# EAGLE design Margay (EAGLE 9.6.2)

## Sheet 1 of 3
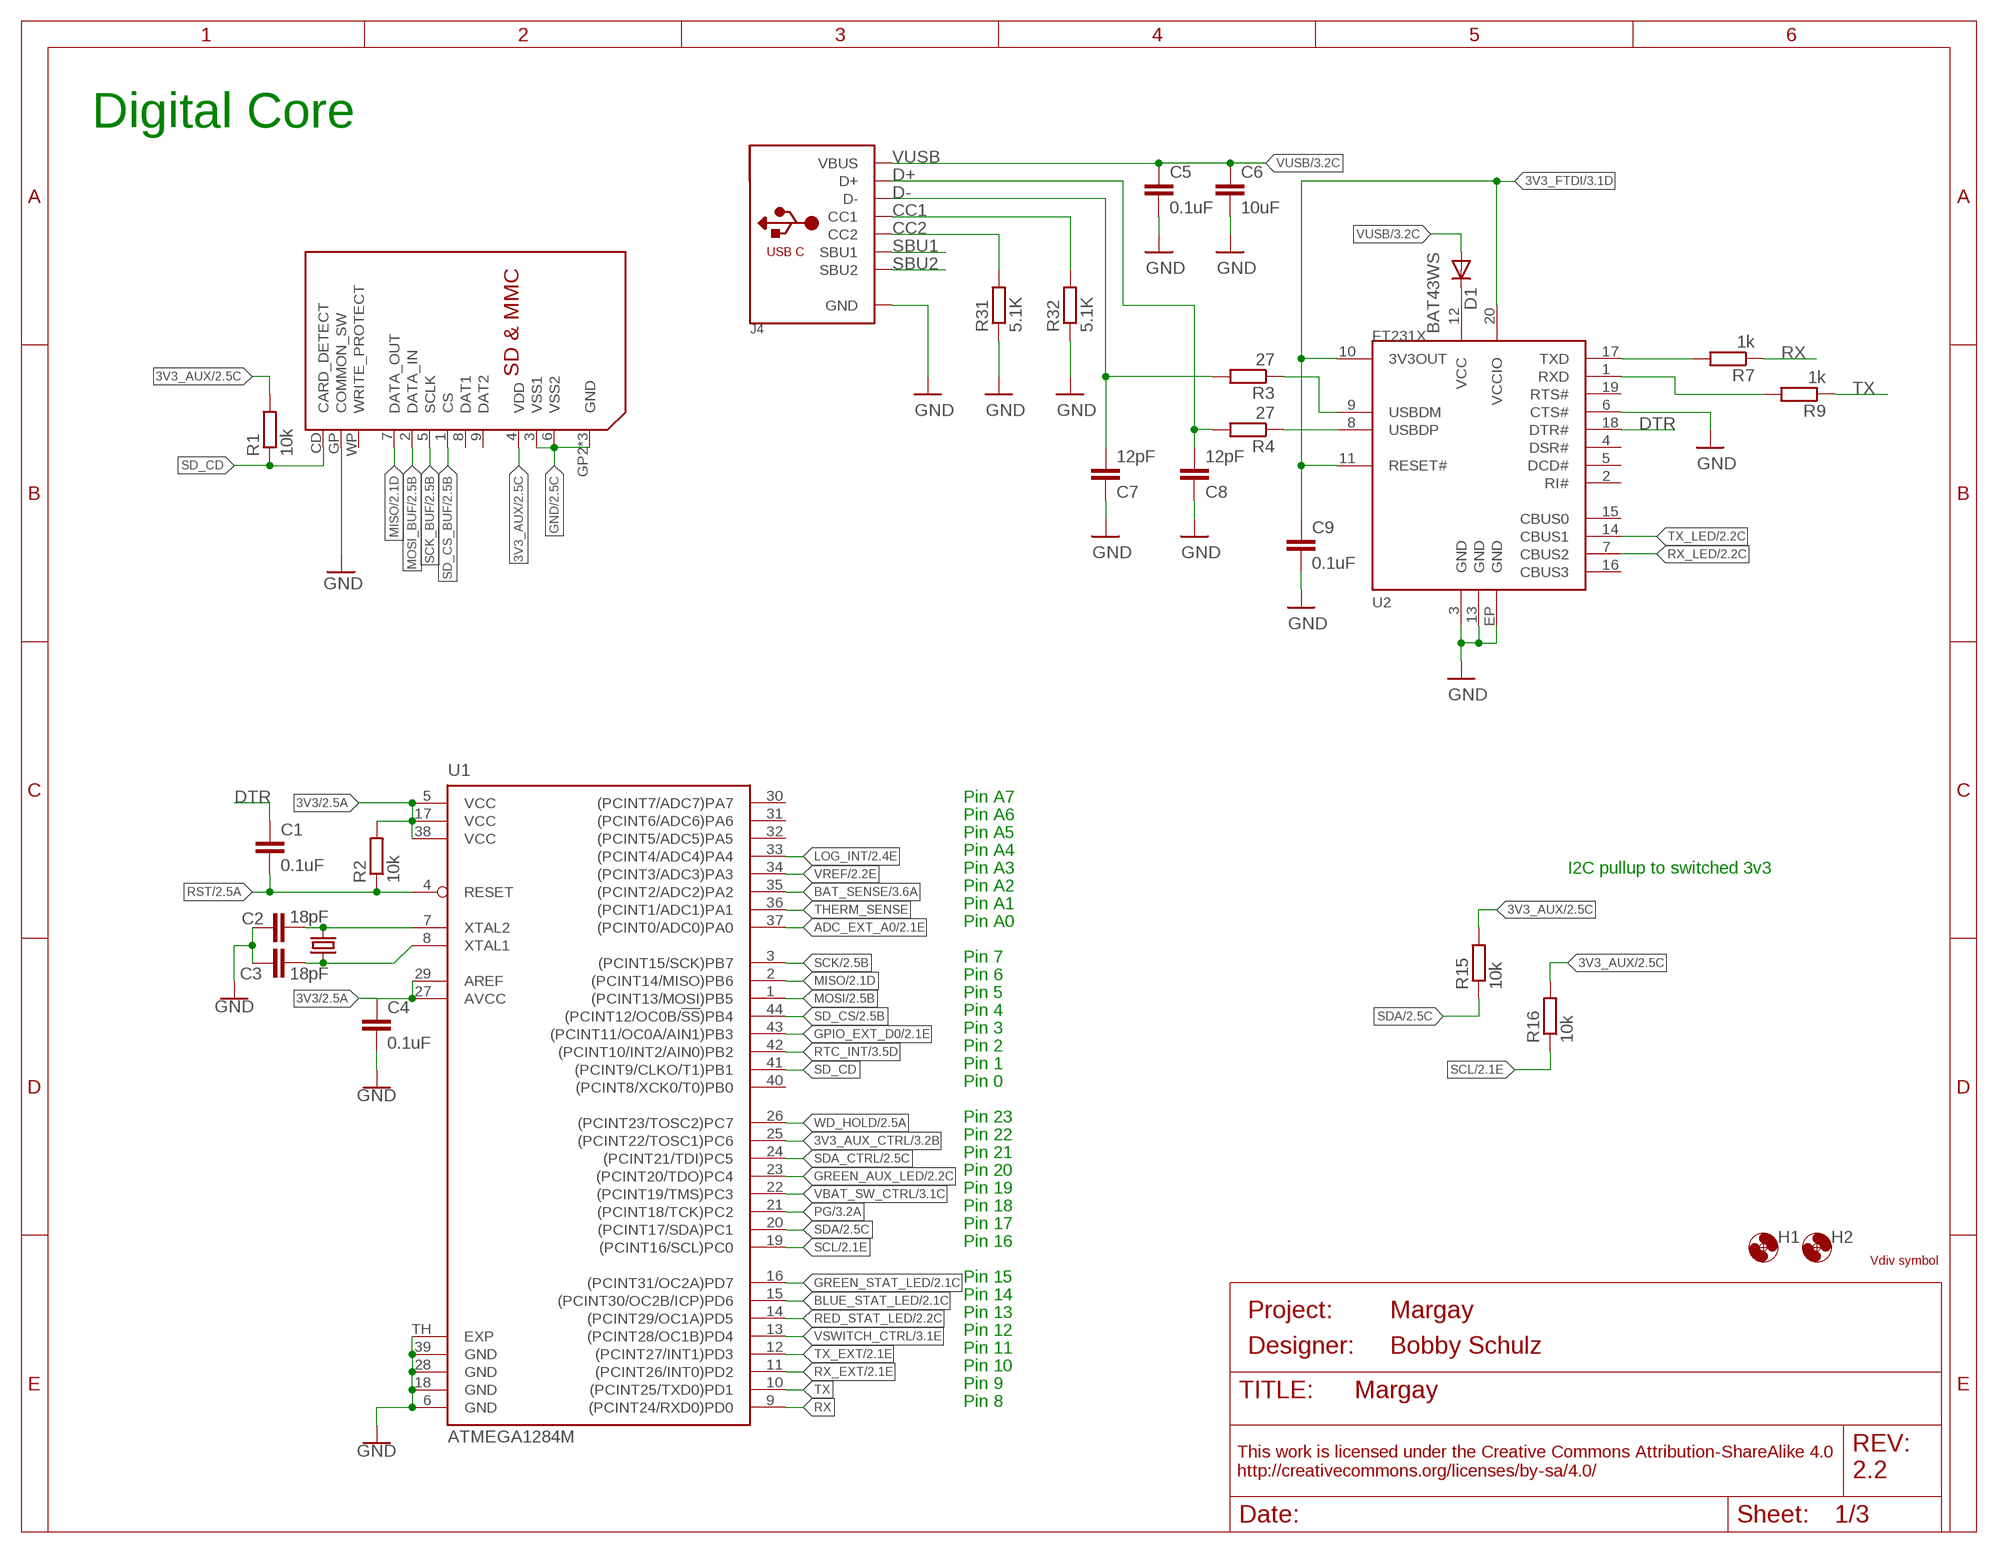
[diagram p0: schematic, sheet 1]
FRAME1 (FRAME_A_L): DESIGNER: Bobby Schulz; PROJECT: Margay; REV: 2.2

### Parts
C1  0.1uF  C-EU0.1UFC0402  [C0402]
C2  18pF  C-EU18PFC0402  [C0402]
C3  18pF  C-EU18PFC0402  [C0402]
C4  0.1uF  C-EU0.1UFC0402  [C0402]
C5  0.1uF  C-EU0.1UFC0402  [C0402]
C6  10uF  C-EU10UFC0805  [C0805]
C7  12pF  C-EU12PFC0402  [C0402]
C8  12pF  C-EU12PFC0402  [C0402]
C9  0.1uF  C-EU0.1UFC0402  [C0402]
D1  BAT43WS  DIODESOD-323  [SOD323-R]
H1  MOUNTING_HOLE4_NP_CLOSE  [4_40_CLOSE]
H2  MOUNTING_HOLE4_NP_CLOSE  [4_40_CLOSE]
J1  SDMMCWR-CRD  [SD_WURTH_WR-CRD]
J4  USB_C  [USB_C_CUSB31-CFM2AX-01-X]
R1  10k  R-EU_10KR0402  [R0402]
R2  10k  R-EU_10KR0402  [R0402]
R3  27  R-EU_27R0402  [R0402]
R4  27  R-EU_27R0402  [R0402]
R7  1k  R-EU_1KR0402  [R0402]
R9  1k  R-EU_1KR0402  [R0402]
R15  10k  R-EU_10KR0402  [R0402]
R16  10k  R-EU_10KR0402  [R0402]
R31  5.1K  R-EU_5.1KR0402  [R0402]
R32  5.1K  R-EU_5.1KR0402  [R0402]
U1  ATMEGA1284M  [MLF44-TH]
U2  FT231X-Q  [QFN20]
U$1  VDIV_MARGAYFULL-VDIV  [VDIV_MARGAY_2021]
XTAL1  CRYSTAL8MHZ5X3.2  [CRYSTAL_5X3.2_2-SMD]

### Nets
3V3: C4.1 R2.2 U1.5(VCC) U1.17(VCC) U1.27(AVCC) U1.29(AREF) U1.38(VCC) ; also sheet 2,3
3V3_AUX: J1.4(VDD) R1.2 R15.2 R16.2 ; also sheet 2,3
3V3_AUX_CTRL: U1.25((PCINT22/TOSC1)PC6) ; also sheet 3
3V3_FTDI: C9.1 U2.10(3V3OUT) U2.11(RESET#) U2.20(VCCIO) ; also sheet 3
ADC_EXT_A0: U1.37((PCINT0/ADC0)PA0) ; also sheet 2
BAT_SENSE: U1.35((PCINT2/ADC2)PA2) ; also sheet 3
BLUE_STAT_LED: U1.15((PCINT30/OC2B/ICP)PD6) ; also sheet 2
CC1: J4.A5(CC1) R32.2
CC2: J4.B5(CC2) R31.2
D+: C8.2 J4.A6(D+) J4.B6(D+) R4.2
D-: C7.2 J4.A7(D-) J4.B7(D-) R3.2
DTR: C1.1 U2.18(DTR#)
GND: C2.1 C3.1 C4.2 C5.2 C6.2 C7.1 C8.1 C9.2 J1.3(VSS1) J1.6(VSS2) J1.GP2(GND) J1.GP3(GND) J1.GP4(GND) J1.GP(COMMON_SW) J4.A1B12(GND) J4.B1A12(GND) R31.1 R32.1 U1.6(GND) U1.18(GND) U1.28(GND) U1.39(GND) U1.TH(EXP) U2.3(GND) U2.6(CTS#) U2.13(GND) U2.EP(GND) ; also sheet 2,3
GPIO_EXT_D0: U1.43((PCINT11/OC0A/AIN1)PB3) ; also sheet 2
GREEN_AUX_LED: U1.23((PCINT20/TDO)PC4) ; also sheet 2
GREEN_STAT_LED: U1.16((PCINT31/OC2A)PD7) ; also sheet 2
LOG_INT: U1.33((PCINT4/ADC4)PA4) ; also sheet 2
MISO: J1.7(DATA_OUT) U1.2((PCINT14/MISO)PB6) ; also sheet 2
MOSI: U1.1((PCINT13/MOSI)PB5) ; also sheet 2
MOSI_BUF: J1.2(DATA_IN) ; also sheet 2
N$7: D1.C U2.12(VCC)
N$25: R7.2 U2.17(TXD)
N$35: R9.2 U2.1(RXD)
N$38: R4.1 U2.8(USBDP)
N$46: R3.1 U2.9(USBDM)
PG: U1.21((PCINT18/TCK)PC2) ; also sheet 3
RED_STAT_LED: U1.14((PCINT29/OC1A)PD5) ; also sheet 2
RST: C1.2 R2.1 U1.4(RESET) ; also sheet 2
RTC_INT: U1.42((PCINT10/INT2/AIN0)PB2) ; also sheet 3
RX: R7.1 U1.9((PCINT24/RXD0)PD0)
RX_EXT: U1.11((PCINT26/INT0)PD2) ; also sheet 2
RX_LED: U2.7(CBUS2) ; also sheet 2
SBU1: J4.A8(SBU1)
SBU2: J4.B8(SBU2)
SCK: U1.3((PCINT15/SCK)PB7) ; also sheet 2
SCK_BUF: J1.5(SCLK) ; also sheet 2
SCL: R16.1 U1.19((PCINT16/SCL)PC0) ; also sheet 2,3
SD_CD: J1.CD(CARD_DETECT) R1.1 U1.41((PCINT9/CLKO/T1)PB1)
SD_CS: U1.44((PCINT12/OC0B/!SS!)PB4) ; also sheet 2
SD_CS_BUF: J1.1(CS) ; also sheet 2
SDA: R15.1 U1.20((PCINT17/SDA)PC1) ; also sheet 2
SDA_CTRL: U1.24((PCINT21/TDI)PC5) ; also sheet 2
THERM_SENSE: U1.36((PCINT1/ADC1)PA1)
TX: R9.1 U1.10((PCINT25/TXD0)PD1)
TX_EXT: U1.12((PCINT27/INT1)PD3) ; also sheet 2
TX_LED: U2.14(CBUS1) ; also sheet 2
VBAT_SW_CTRL: U1.22((PCINT19/TMS)PC3) ; also sheet 3
VREF: U1.34((PCINT3/ADC3)PA3) ; also sheet 2,3
VSWITCH_CTRL: U1.13((PCINT28/OC1B)PD4) ; also sheet 3
VUSB: C5.1 C6.1 D1.A J4.A4B9(VBUS) J4.B4A9(VBUS) ; also sheet 3
WD_HOLD: U1.26((PCINT23/TOSC2)PC7) ; also sheet 2
XTAL1: C3.2 U1.8(XTAL1) XTAL1.OSC1
XTAL2: C2.2 U1.7(XTAL2) XTAL1.OSC2
Unconnected: J1.8(DAT1) J1.9(DAT2) J1.WP(WRITE_PROTECT) U1.30((PCINT7/ADC7)PA7) U1.31((PCINT6/ADC6)PA6) U1.32((PCINT5/ADC5)PA5) U1.40((PCINT8/XCK0/T0)PB0) U2.2(RI#) U2.4(DSR#) U2.5(DCD#) U2.15(CBUS0) U2.16(CBUS3) U2.19(RTS#)

### Notes on the sheet
- Digital Core
- Pin A7
- Pin A6
- Pin A5
- Pin A4
- Pin A3 | I2C pullup to switched 3v3
- Pin A2
- Pin A1
- Pin A0
- Pin 7
- Pin 6
- Pin 5
- Pin 4
- Pin 3
- Pin 2
- Pin 1
- Pin 0
- Pin 23
- Pin 22
- Pin 21
- Pin 20
- Pin 19
- Pin 18
- Pin 17
- Pin 16
- Pin 15
- Pin 14
- Pin 13
- Pin 12
- Pin 11
- Pin 10
- Pin 9
- Pin 8

## Sheet 2 of 3
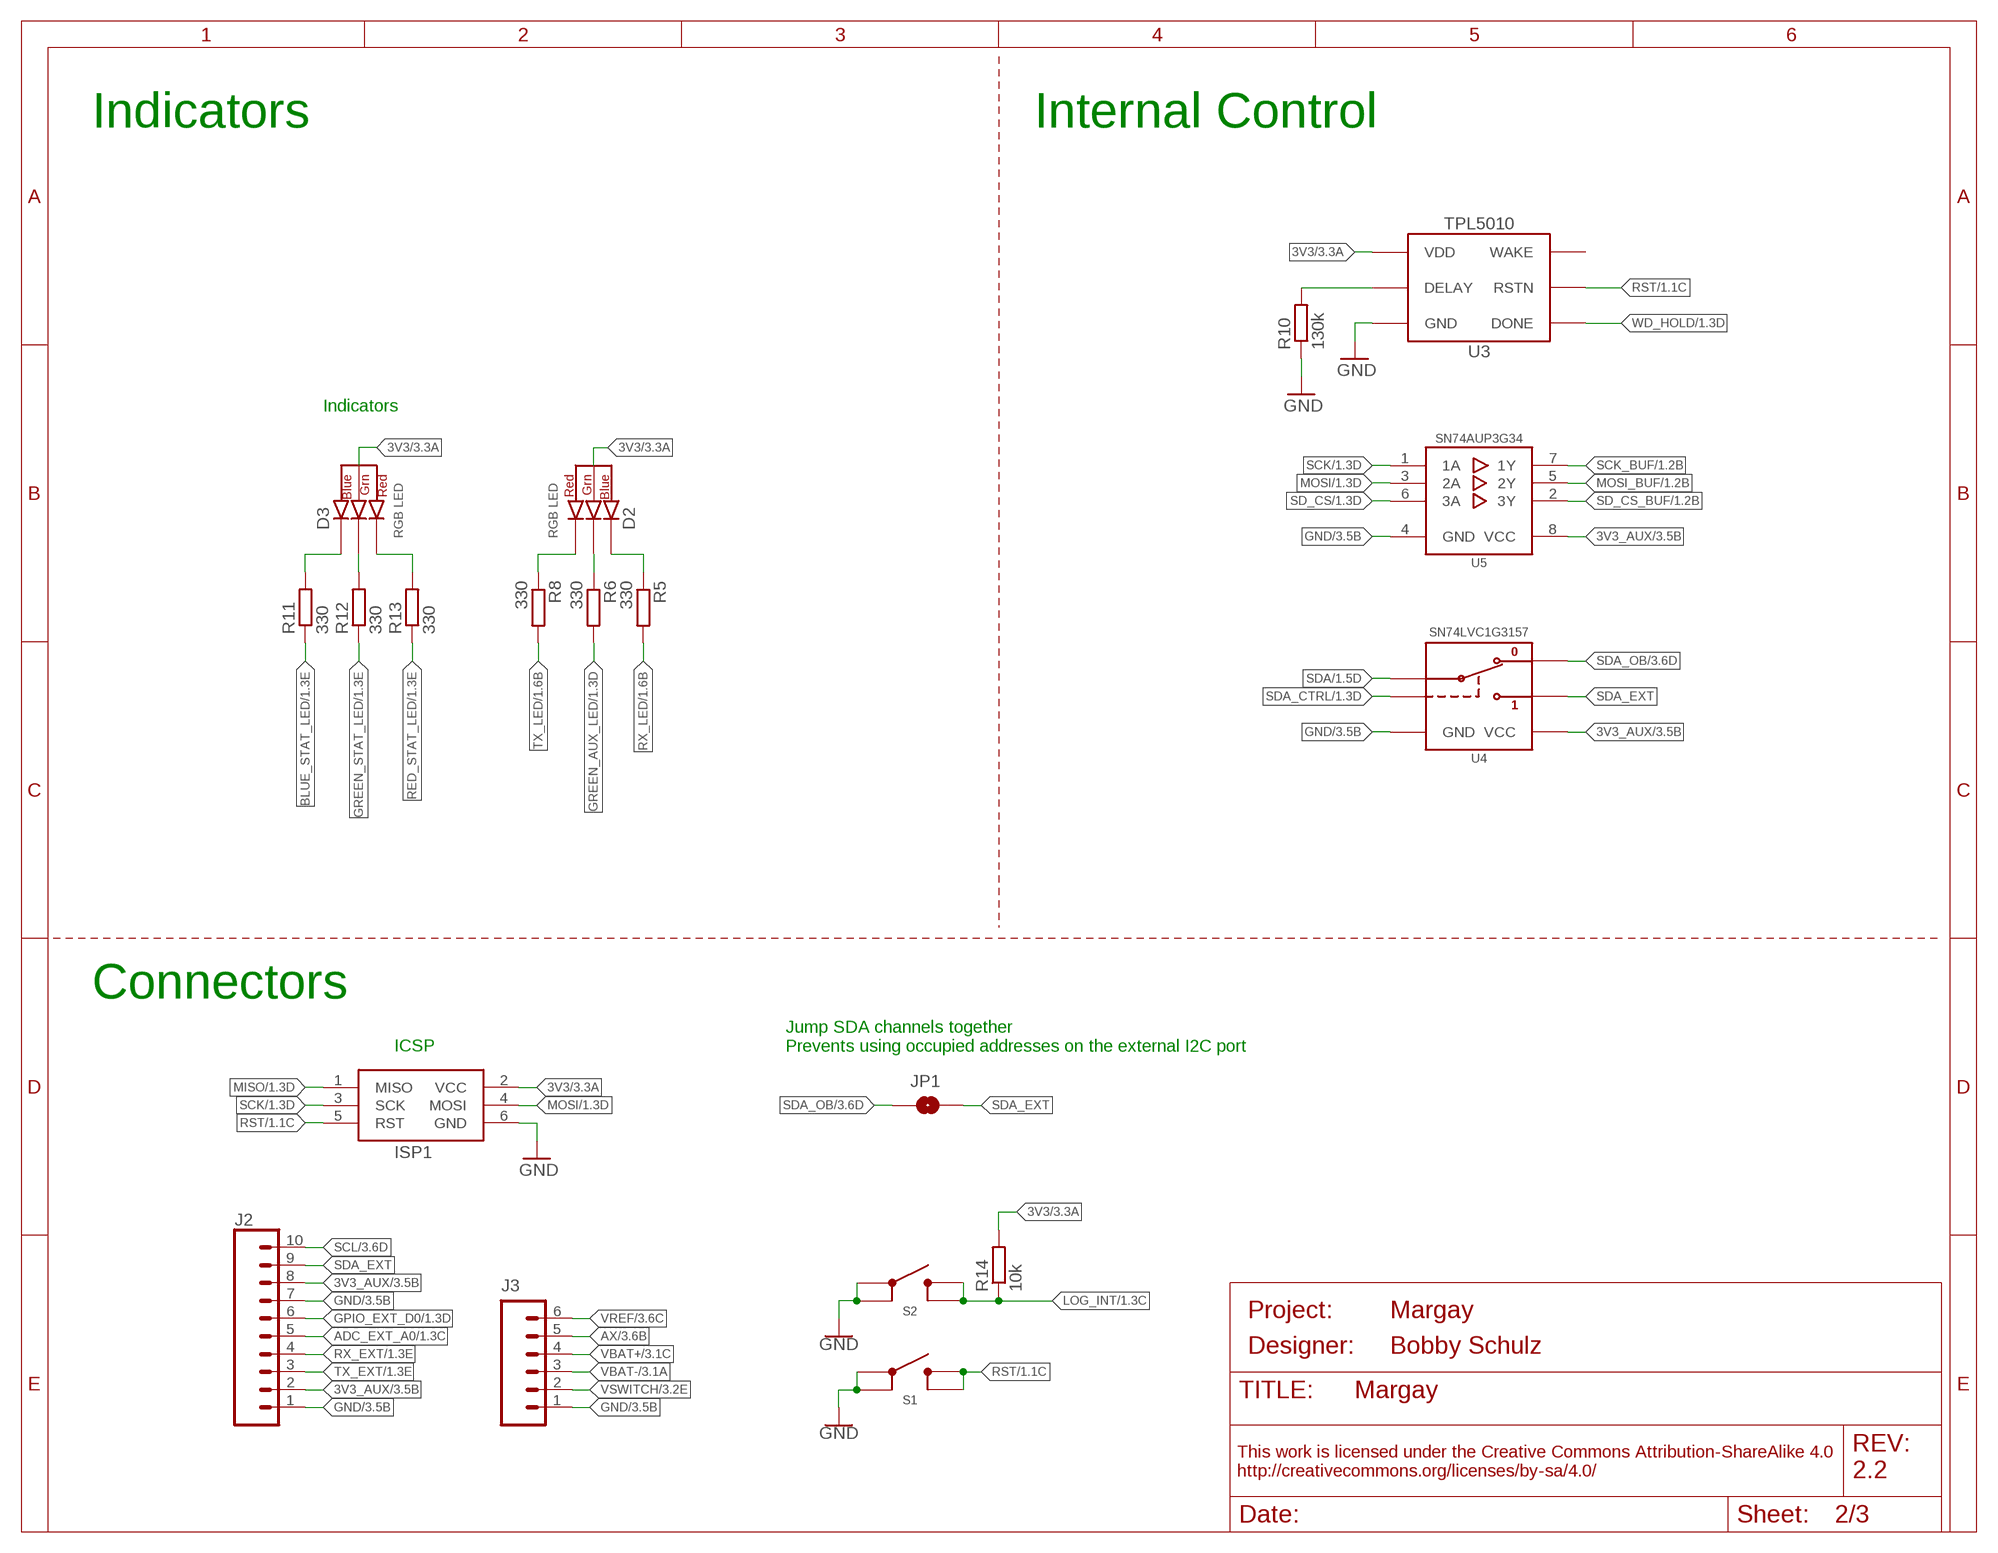
[diagram p1: schematic, sheet 2]
FRAME2 (FRAME_A_L): DESIGNER: Bobby Schulz; PROJECT: Margay; REV: 2.2

### Parts
D2  CLVBA-FKA  [CLVBA-FKA]
D3  CLVBA-FKA  [CLVBA-FKA]
ISP1  AVRISP-6  [AVRISP]
J2  CONN_102.54_SCREW  [1X10_SCREW]
J3  CONN_6SCREW_2.54  [1X06_SCREW]
JP1  JUMPER-SMT_2_NO_SILK  [SMT-JUMPER_2_NO_SILK]
R5  330  R-EU_330R0402  [R0402]
R6  330  R-EU_330R0402  [R0402]
R8  330  R-EU_330R0402  [R0402]
R10  130k  R-EU_130KR0603  [R0603]
R11  330  R-EU_330R0402  [R0402]
R12  330  R-EU_330R0402  [R0402]
R13  330  R-EU_330R0402  [R0402]
R14  10k  R-EU_10KR0402  [R0402]
S1  BUTTON4.2X3.2  [SWITCH_4.2X3.2]
S2  BUTTON4.2X3.2  [SWITCH_4.2X3.2]
U3  TPL5010DDC  [DDC_R-PDSO-G6]
U4  SN74LVC1G3157SC70  [DCK_R-PDSO-G6]
U5  SN74AUP3G34DCU  [DCU_(R-PDSO-G8)]

### Nets
3V3: D2.2(ANODE) D3.2(ANODE) ISP1.2(VCC) R14.2 U3.1(VDD) ; also sheet 1,3
3V3_AUX: J2.2 J2.8 U4.5(VCC) U5.8(VCC) ; also sheet 1,3
_BLUE_RX_AUX_LED: D2.3(BLUE_CATH) R5.1
_BLUE_STAT_LED: D3.3(BLUE_CATH) R11.2
_GREEN_AUX_LED: D2.4(GREEN_CATH) R6.1
_GREEN_STAT_LED: D3.4(GREEN_CATH) R12.2
_RED_STAT_LED: D3.1(RED_CATH) R13.2
_RED_TX_AUX_LED: D2.1(RED_CATH) R8.1
ADC_EXT_A0: J2.5 ; also sheet 1
AX: J3.5 ; also sheet 3
BLUE_STAT_LED: R11.1 ; also sheet 1
GND: ISP1.6(GND) J2.1 J2.7 J3.1 R10.1 S1.1 S1.2 S2.1 S2.2 U3.2(GND) U4.2(GND) U5.4(GND) ; also sheet 1,3
GPIO_EXT_D0: J2.6 ; also sheet 1
GREEN_AUX_LED: R6.2 ; also sheet 1
GREEN_STAT_LED: R12.1 ; also sheet 1
LOG_INT: R14.1 S2.3 S2.4 ; also sheet 1
MISO: ISP1.1(MISO) ; also sheet 1
MOSI: ISP1.4(MOSI) U5.3(2A) ; also sheet 1
MOSI_BUF: U5.5(2Y) ; also sheet 1
N$2: R10.2 U3.3(DELAY)
RED_STAT_LED: R13.1 ; also sheet 1
RST: ISP1.5(RST) S1.3 S1.4 U3.6(RSTN) ; also sheet 1
RX_EXT: J2.4 ; also sheet 1
RX_LED: R5.2 ; also sheet 1
SCK: ISP1.3(SCK) U5.1(1A) ; also sheet 1
SCK_BUF: U5.7(1Y) ; also sheet 1
SCL: J2.10 ; also sheet 1,3
SD_CS: U5.6(3A) ; also sheet 1
SD_CS_BUF: U5.2(3Y) ; also sheet 1
SDA: U4.4(A) ; also sheet 1
SDA_CTRL: U4.6(S) ; also sheet 1
SDA_EXT: J2.9 JP1.2 U4.1(B2)
SDA_OB: JP1.1 U4.3(B1) ; also sheet 3
TX_EXT: J2.3 ; also sheet 1
TX_LED: R8.2 ; also sheet 1
VBAT+: J3.4 ; also sheet 3
VBAT-: J3.3 ; also sheet 3
VREF: J3.6 ; also sheet 1,3
VSWITCH: J3.2 ; also sheet 3
WD_HOLD: U3.4(DONE) ; also sheet 1
Unconnected: U3.5(WAKE)

### Notes on the sheet
- Indicators | Internal Control
- Indicators
- Connectors
- ICSP
- Jump SDA channels together
  Prevents using occupied addresses on the external I2C port

## Sheet 3 of 3
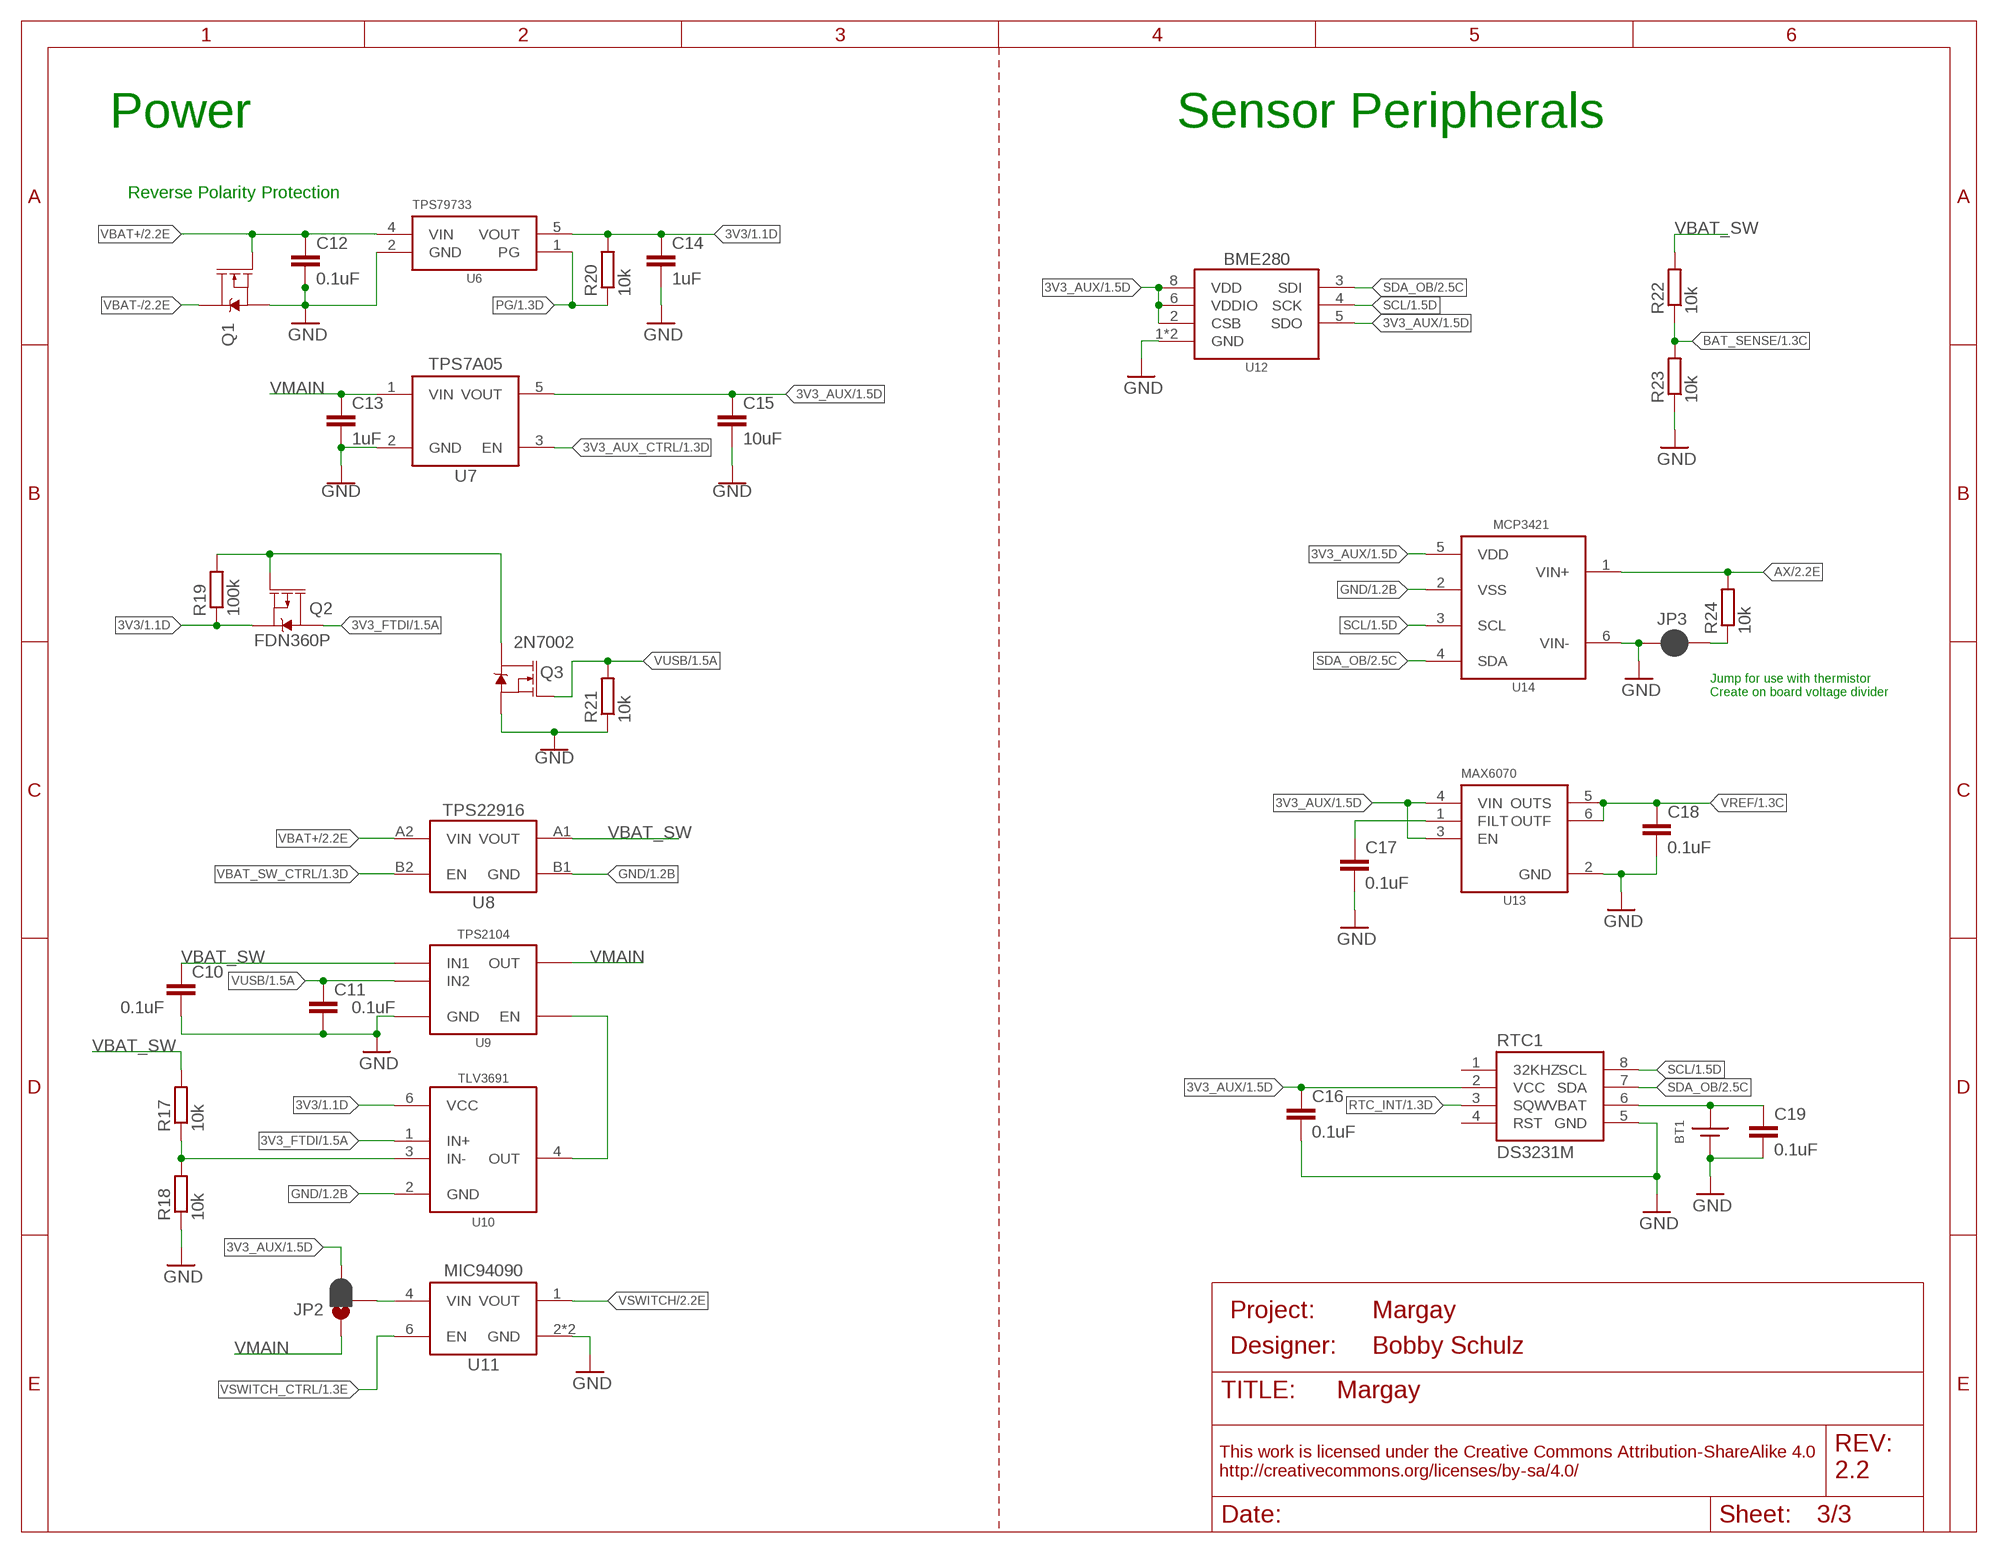
[diagram p2: schematic, sheet 3]
FRAME3 (FRAME_A_L): DESIGNER: Bobby Schulz; PROJECT: Margay; REV: 2.2

### Parts
BT1  BATTERY_COIN12MM  [LINX_BAT-HLD-012-SMT]
C10  0.1uF  C-EU0.1UFC0402  [C0402]
C11  0.1uF  C-EU0.1UFC0402  [C0402]
C12  0.1uF  C-EU0.1UFC0402  [C0402]
C13  1uF  C-EU1UFC0603  [C0603]
C14  1uF  C-EU1UFC0603  [C0603]
C15  10uF  C-EU10UFC0805  [C0805]
C16  0.1uF  C-EU0.1UFC0402  [C0402]
C17  0.1uF  C-EU0.1UFC0402  [C0402]
C18  0.1uF  C-EU0.1UFC0402  [C0402]
C19  0.1uF  C-EU0.1UFC0402  [C0402]
JP2  JUMPER-SMT_3_1-NC_PASTE_SILK  [SMT-JUMPER_3_1-NC_PASTE_SILK]
JP3  JUMPER-SMT_2_NC_PASTE_SILK  [SMT-JUMPER_2_NC_PASTE_SILK]
Q1  DMG3404  MOSFET-NCH-DMG3404L  [SOT23-3]
Q2  FDN360P  MOSFET_PCH-FDN360P  [SOT23-3@1]
Q3  2N7002  MOSFET-NCH-2N7002PW  [SOT323]
R17  10k  R-EU_10KR0402  [R0402]
R18  10k  R-EU_10KR0402  [R0402]
R19  100k  R-EU_100R0402  [R0402]
R20  10k  R-EU_10KR0402  [R0402]
R21  10k  R-EU_10KR0402  [R0402]
R22  10k  R-EU_10KR0603  [R0603]
R23  10k  R-EU_10KR0603  [R0603]
R24  10k  R-EU_P10KR0603  [R0603]
RTC1  DS3231M  [SO08]
U6  TPS79733  [DCK_R-PDSO-G5]
U7  TPS7A0533DBV  [SOT23-5]
U8  TPS22916YFP  [YFP0004]
U9  TPS2104  [SOT23-5]
U10  TLV3691DPF  [DPF0006A]
U11  MIC94090C6  [SC-70_6]
U12  BME280  [BME280]
U13  MAX6070AAUT18  [SOT23-6L]
U14  MCP3421A1  [SOT23-6L]

### Nets
3V3: C14.1 Q2.2(S) R19.1 R20.2 U6.5(VOUT) U10.6(VCC) ; also sheet 1,2
3V3_AUX: C15.1 C16.1 JP2.3 RTC1.2(VCC) U7.5(VOUT) U12.2(CSB) U12.5(SDO) U12.6(VDDIO) U12.8(VDD) U13.3(EN) U13.4(VIN) U14.5(VDD) ; also sheet 1,2
3V3_AUX_CTRL: U7.3(EN) ; also sheet 1
3V3_FTDI: Q2.3(D) U10.1(IN+) ; also sheet 1
AX: R24.2 U14.1(VIN+) ; also sheet 2
BAT_SENSE: R22.1 R23.2 ; also sheet 1
GND: BT1.GND(-) C10.2 C11.2 C12.2 C13.2 C14.2 C15.2 C16.2 C17.2 C18.2 C19.2 JP3.1 Q1.2(S) Q3.2(S) R18.1 R21.1 R23.1 RTC1.5(GND) U6.2(GND) U7.2(GND) U8.B1(GND) U9.2(GND) U10.2(GND) U11.2(GND) U11.5(GND) U12.1(GND) U12.7(GND) U13.2(GND) U14.2(VSS) U14.6(VIN-) ; also sheet 1,2
N$3: JP2.2 U11.4(VIN)
N$6: Q2.1(G) Q3.3(D) R19.2
N$11: C17.1 U13.1(FILT)
N$12: R17.1 R18.2 U10.3(IN-)
N$14: U9.1(EN) U10.4(OUT)
PG: R20.1 U6.1(PG) ; also sheet 1
RTC_INT: RTC1.3(SQW) ; also sheet 1
SCL: RTC1.8(SCL) U12.4(SCK) U14.3(SCL) ; also sheet 1,2
SDA_OB: RTC1.7(SDA) U12.3(SDI) U14.4(SDA) ; also sheet 2
VBAT+: C12.1 Q1.1(G) U6.4(VIN) U8.A2(VIN) ; also sheet 2
VBAT-: Q1.3(D) ; also sheet 2
VBAT_SW: C10.1 R17.2 R22.2 U8.A1(VOUT) U9.5(IN1)
VBAT_SW_CTRL: U8.B2(EN) ; also sheet 1
VCOIN+: BT1.POWER0(+) BT1.POWER1(+) C19.1 RTC1.6(VBAT)
VDIV_AX: JP3.2 R24.1
VMAIN: C13.1 JP2.1 U7.1(VIN) U9.4(OUT)
VREF: C18.1 U13.5(OUTS) U13.6(OUTF) ; also sheet 1,2
VSWITCH: U11.1(VOUT) ; also sheet 2
VSWITCH_CTRL: U11.6(EN) ; also sheet 1
VUSB: C11.1 Q3.1(G) R21.2 U9.3(IN2) ; also sheet 1
Unconnected: RTC1.1(32KHZ) RTC1.4(RST)

### Notes on the sheet
- Power | Sensor Peripherals
- Reverse Polarity Protection
- Jump for use with thermistor 
  Create on board voltage divider

## Library data of the parts
BT1 = bschulz:BATTERY_COIN: Coin Cell Battery Holder; DIGIKEY: BAT-HLD-012-SMT-ND; MF: Linx; MPN: BAT-HLD-012-SMT
C1 C4 C5 C9-C12 C16-C19 = bschulz_passives:C-EU: CAPACITOR, European symbol; DIGIKEY: 490-4759-1-ND; MF: Murata; MPN: GCM155R71C104KA55D
C2 C3 = bschulz_passives:C-EU: CAPACITOR, European symbol; DIGIKEY: 490-12650-1-ND; MF: Murata; MPN: GCM1555C1H180JA16D
C6 C15 = bschulz_passives:C-EU: CAPACITOR, European symbol; DIGIKEY: 490-6473-1-ND; MF: Murata; MPN: GRM21BR61C106KE15K
C7 C8 = bschulz_passives:C-EU: CAPACITOR, European symbol; DIGIKEY: 445-5585-1-ND; MF: TDK; MPN: CGA2B2C0G1H120J050BA
C13 C14 = bschulz_passives:C-EU: CAPACITOR, European symbol; DIGIKEY: 587-2984-1-ND; MF: Yaiyo Yuden; MPN: TMK107B7105KA-T
D1 = bschulz:DIODE: Genaric Diode; DIGIKEY: BAT43WS-FDICT-ND; MF: Diodes Incorporated; MPN: BAT43WS-7-F
D2 D3 = bschulz:CLVBA-FKA: Cree RGB LED, Small Package, Common Anode, CLVBA-FKA Digikey: https://www.digikey.com/product-detail/en/cree-inc/CLVBA-FKA-CAEDH8BBB7A363/CLVBA-FKA-CAEDH8BBB7A363CT-ND/2650500; DIGIKEY: CLVBA-FKA-CAEDH8BBB7A363CT-ND; MF: Cree; MPN: CLVBA-FKA-CAEDH8BBB7A363
H1 H2 = bschulz:MOUNTING_HOLE: Genaric Mechanical Mounting Hole Hole diameter based on max body diameter + 15% Keepout ring is for diameter of socket cap screw (minimum required clearance) TPlace ring is for diameter of pan head screw (recomended clearance) Specifications: Socket Cap <http://fastener-express.com/fastener-technical/SocketscapSS-Alloy.pdf> Button Head Socket Cap <http://fastener-express.com/fastener-technical/Button-Socket-alloy.pdf> Pan Head <http://fastener-express.com/fastener-technical/pan-machine-Screws.pdf>
ISP1 = bschulz:AVRISP: AVR ISP HEADER Standard 6 pin header for AVR programming; DIGIKEY: 609-3234-ND; MF: Amphenol; MPN: 67997-206HLF
J1 = bschulz:SDMMC: SD MMC Card holder 4UCON part #06132 - easy to solder; DIGIKEY: 732-3817-1-ND; MF: Wurth; MPN: 693063010911
J2 = bschulz:CONN_10: Genaric 10 terminal header Digikey 2.54_SCREW <https://www.digikey.com/product-detail/en/on-shore-technology-inc/OSTVN10A150/ED10567-ND/1588870> 3.5_SCREW <https://www.digikey.com/product-detail/en/on-shore-technology-inc/OSTTE100104/ED2735-ND/2351811>; DIGIKEY: ED10567-ND; MF: On Shore; MPN: OSTVN10A150
J3 = bschulz:CONN_6: Genaric 6 terminal header Digikey 2.54_SCREW <https://www.digikey.com/product-detail/en/on-shore-technology-inc/OSTVN06A150/ED10565-ND/1588866>; DIGIKEY: ED10565-ND; MF: OnShore; MPN: OSTVN06A150
J4 = microbuilder:USB_C: USB Type-C USB 2.0 Connector; DIGIKEY: 2073-USB4105-GF-ACT-ND; MF: GCT; MPN: USB4105-GF-A
JP1 = bschulz:JUMPER-SMT_2_NO: Normally open jumper This jumper has two pads in close proximity to each other. Apply solder to close the connection. Round pads are easier to solder for beginners, but are a lot larger. SparkFun Product that uses the round pads: SparkFun EL Sequencer <https://www.sparkfun.com/products/12781>; DIGIKEY: DNP; MF: N/A; MPN: N/A
JP2 = bschulz:JUMPER-SMT_3_1-NC_PASTE: Normally closed solder jumper (1 of 2 connections) This jumper has an aperture in the stencil to allow solder paste to bridge one of the two connections. One connection is normally closed (NC), while the other is normally open (NO). Wick off the solder to open the connection. Reapply solder to reclose the connection. Apply solder to the other side instead to change the current path.; DIGIKEY: DNP; MF: N/A; MPN: N/A
JP3 = bschulz:JUMPER-SMT_2_NC_PASTE: Normally closed solder jumper This jumper has an aperture in the stencil to allow solder paste to bridge the split in the wire so it's normally closed (NC). Wick off the solder to open the connection. Reapply solder to reclose the connection.; DIGIKEY: DNP; MF: N/A; MPN: N/A
Q1 = bschulz:MOSFET-NCH: N-channel MOSFET Small Signal/Low Power: BSS138 2N7002P 2N7002PW RE1C002UN; DIGIKEY: DMG3404L-7DICT-ND; MF: Diodes Incorporated; MPN: DMG3404L-7
Q2 = bschulz:MOSFET_PCH: P-channel MOSFETs Voltage controlled devices that allow control of high current outputs. SparkFun Products: SparkFun ESP32 Thing <https://www.sparkfun.com/products/13907> SparkFun ESP8266 Thing <https://www.sparkfun.com/products/13231>; DIGIKEY: DMP3099L-7DICT-ND; MF: Diodes Inc; MPN: DMP3099L-7
Q3 = bschulz:MOSFET-NCH: N-channel MOSFET Small Signal/Low Power: BSS138 2N7002P 2N7002PW RE1C002UN; DIGIKEY: 2N7002W-FDICT-ND; MF: Diodes Incorporated; MPN: 2N7002W-7-F; PROD_ID: TRANS-11151
R1 R2 R14-R18 R20 R21 = bschulz_passives:R-EU_: RESISTOR, European symbol Digikey Parts: Yageo, 0402 <https://www.digikey.com/products/en/resistors/chip-resistor-surface-mount/52?k=&pkeyword=&sv=0&s=4356&sf=1&FV=-1%7C13%2C7%7C2%2C1291%7C39157%2C1989%7C0%2C-8%7C52%2C3%7C1131%2C3%7C2503&quantity=&ColumnSort=0&page=1&stock=1&pageSize=25> Yageo, 0603 <https://www.digikey.com/products/en/resistors/chip-resistor-surface-mount/52?k=&pkeyword=&sv=0&pv1291=39245&sf=1&FV=-5%7C4356%2C-5%7C47360%2C-8%7C52%2C-1%7C13%2C7%7C2%2C1989%7C0&quantity=10&ColumnSort=1000011&page=1&stock=1&pageSize=25> Panasonic, 0603 <https://www.digikey.com/products/en/resistors/chip-resistor-surface-mount/52?k=&pkeyword=&pv252=68&sf=0&FV=ffec373d%2C1c0002%2C142c040c%2C1f140000%2Cffe00034%2C80002%2Cc0001&quantity=&ColumnSort=0&page=1&stock=1&pageSize=25> Panasonic, precision, 0603 <https://www.digikey.com/products/en/resistors/chip-resistor-surface-mount/52?FV=ffec4907%2Cfffc000a%2Cc0172%2C142c040c%2C1f140000%2Cffe00034%2C1c0002&quantity=100&ColumnSort=2085&page=1&stock=1&pageSize=25> Panasonic, 0805 <https://www.digikey.com/products/en/resistors/chip-resistor-surface-mount/52?k=&pkeyword=&pv3=1&sf=0&FV=ffec373d%2C1c0002%2C1f140000%2Cffe00034%2C142c040d&quantity=&ColumnSort=0&page=1&stock=1&pageSize=25> Rohm, current sense <https://www.digikey.com/products/en/resistors/chip-resistor-surface-mount/52?k=&pkeyword=&pv3=1&sf=0&FV=ffecb688%2C1f140000%2Cffe00034%2C1c0002&quantity=&ColumnSort=0&page=1&stock=1&pageSize=25> Vishay, pulse proof automotive <https://www.digikey.com/products/en/resistors/chip-resistor-surface-mount/52?k=&pkeyword=&pv7=2&sf=0&FV=ffec5d6b%2Cffe00034%2C1f140000&quantity=&ColumnSort=0&page=1&stock=1&pageSize=25>; DIGIKEY: 311-10.0KLRCT-ND; MF: Yageo; MPN: RC0402FR-0710KL; VALUE_PART: 10k
R3 R4 = bschulz_passives:R-EU_: RESISTOR, European symbol Digikey Parts: Yageo, 0402 <https://www.digikey.com/products/en/resistors/chip-resistor-surface-mount/52?k=&pkeyword=&sv=0&s=4356&sf=1&FV=-1%7C13%2C7%7C2%2C1291%7C39157%2C1989%7C0%2C-8%7C52%2C3%7C1131%2C3%7C2503&quantity=&ColumnSort=0&page=1&stock=1&pageSize=25> Yageo, 0603 <https://www.digikey.com/products/en/resistors/chip-resistor-surface-mount/52?k=&pkeyword=&sv=0&pv1291=39245&sf=1&FV=-5%7C4356%2C-5%7C47360%2C-8%7C52%2C-1%7C13%2C7%7C2%2C1989%7C0&quantity=10&ColumnSort=1000011&page=1&stock=1&pageSize=25> Panasonic, 0603 <https://www.digikey.com/products/en/resistors/chip-resistor-surface-mount/52?k=&pkeyword=&pv252=68&sf=0&FV=ffec373d%2C1c0002%2C142c040c%2C1f140000%2Cffe00034%2C80002%2Cc0001&quantity=&ColumnSort=0&page=1&stock=1&pageSize=25> Panasonic, precision, 0603 <https://www.digikey.com/products/en/resistors/chip-resistor-surface-mount/52?FV=ffec4907%2Cfffc000a%2Cc0172%2C142c040c%2C1f140000%2Cffe00034%2C1c0002&quantity=100&ColumnSort=2085&page=1&stock=1&pageSize=25> Panasonic, 0805 <https://www.digikey.com/products/en/resistors/chip-resistor-surface-mount/52?k=&pkeyword=&pv3=1&sf=0&FV=ffec373d%2C1c0002%2C1f140000%2Cffe00034%2C142c040d&quantity=&ColumnSort=0&page=1&stock=1&pageSize=25> Rohm, current sense <https://www.digikey.com/products/en/resistors/chip-resistor-surface-mount/52?k=&pkeyword=&pv3=1&sf=0&FV=ffecb688%2C1f140000%2Cffe00034%2C1c0002&quantity=&ColumnSort=0&page=1&stock=1&pageSize=25> Vishay, pulse proof automotive <https://www.digikey.com/products/en/resistors/chip-resistor-surface-mount/52?k=&pkeyword=&pv7=2&sf=0&FV=ffec5d6b%2Cffe00034%2C1f140000&quantity=&ColumnSort=0&page=1&stock=1&pageSize=25>; DIGIKEY: YAG3086CT-ND; MF: Yageo; MPN: RC0402FR-0727RL; VALUE_PART: 27
R5 R6 R8 R11-R13 = bschulz_passives:R-EU_: RESISTOR, European symbol Digikey Parts: Yageo, 0402 <https://www.digikey.com/products/en/resistors/chip-resistor-surface-mount/52?k=&pkeyword=&sv=0&s=4356&sf=1&FV=-1%7C13%2C7%7C2%2C1291%7C39157%2C1989%7C0%2C-8%7C52%2C3%7C1131%2C3%7C2503&quantity=&ColumnSort=0&page=1&stock=1&pageSize=25> Yageo, 0603 <https://www.digikey.com/products/en/resistors/chip-resistor-surface-mount/52?k=&pkeyword=&sv=0&pv1291=39245&sf=1&FV=-5%7C4356%2C-5%7C47360%2C-8%7C52%2C-1%7C13%2C7%7C2%2C1989%7C0&quantity=10&ColumnSort=1000011&page=1&stock=1&pageSize=25> Panasonic, 0603 <https://www.digikey.com/products/en/resistors/chip-resistor-surface-mount/52?k=&pkeyword=&pv252=68&sf=0&FV=ffec373d%2C1c0002%2C142c040c%2C1f140000%2Cffe00034%2C80002%2Cc0001&quantity=&ColumnSort=0&page=1&stock=1&pageSize=25> Panasonic, precision, 0603 <https://www.digikey.com/products/en/resistors/chip-resistor-surface-mount/52?FV=ffec4907%2Cfffc000a%2Cc0172%2C142c040c%2C1f140000%2Cffe00034%2C1c0002&quantity=100&ColumnSort=2085&page=1&stock=1&pageSize=25> Panasonic, 0805 <https://www.digikey.com/products/en/resistors/chip-resistor-surface-mount/52?k=&pkeyword=&pv3=1&sf=0&FV=ffec373d%2C1c0002%2C1f140000%2Cffe00034%2C142c040d&quantity=&ColumnSort=0&page=1&stock=1&pageSize=25> Rohm, current sense <https://www.digikey.com/products/en/resistors/chip-resistor-surface-mount/52?k=&pkeyword=&pv3=1&sf=0&FV=ffecb688%2C1f140000%2Cffe00034%2C1c0002&quantity=&ColumnSort=0&page=1&stock=1&pageSize=25> Vishay, pulse proof automotive <https://www.digikey.com/products/en/resistors/chip-resistor-surface-mount/52?k=&pkeyword=&pv7=2&sf=0&FV=ffec5d6b%2Cffe00034%2C1f140000&quantity=&ColumnSort=0&page=1&stock=1&pageSize=25>; DIGIKEY: 311-330LRCT-ND; MF: Yageo; MPN: RC0402FR-07330RL; VALUE_PART: 330
R7 R9 = bschulz_passives:R-EU_: RESISTOR, European symbol Digikey Parts: Yageo, 0402 <https://www.digikey.com/products/en/resistors/chip-resistor-surface-mount/52?k=&pkeyword=&sv=0&s=4356&sf=1&FV=-1%7C13%2C7%7C2%2C1291%7C39157%2C1989%7C0%2C-8%7C52%2C3%7C1131%2C3%7C2503&quantity=&ColumnSort=0&page=1&stock=1&pageSize=25> Yageo, 0603 <https://www.digikey.com/products/en/resistors/chip-resistor-surface-mount/52?k=&pkeyword=&sv=0&pv1291=39245&sf=1&FV=-5%7C4356%2C-5%7C47360%2C-8%7C52%2C-1%7C13%2C7%7C2%2C1989%7C0&quantity=10&ColumnSort=1000011&page=1&stock=1&pageSize=25> Panasonic, 0603 <https://www.digikey.com/products/en/resistors/chip-resistor-surface-mount/52?k=&pkeyword=&pv252=68&sf=0&FV=ffec373d%2C1c0002%2C142c040c%2C1f140000%2Cffe00034%2C80002%2Cc0001&quantity=&ColumnSort=0&page=1&stock=1&pageSize=25> Panasonic, precision, 0603 <https://www.digikey.com/products/en/resistors/chip-resistor-surface-mount/52?FV=ffec4907%2Cfffc000a%2Cc0172%2C142c040c%2C1f140000%2Cffe00034%2C1c0002&quantity=100&ColumnSort=2085&page=1&stock=1&pageSize=25> Panasonic, 0805 <https://www.digikey.com/products/en/resistors/chip-resistor-surface-mount/52?k=&pkeyword=&pv3=1&sf=0&FV=ffec373d%2C1c0002%2C1f140000%2Cffe00034%2C142c040d&quantity=&ColumnSort=0&page=1&stock=1&pageSize=25> Rohm, current sense <https://www.digikey.com/products/en/resistors/chip-resistor-surface-mount/52?k=&pkeyword=&pv3=1&sf=0&FV=ffecb688%2C1f140000%2Cffe00034%2C1c0002&quantity=&ColumnSort=0&page=1&stock=1&pageSize=25> Vishay, pulse proof automotive <https://www.digikey.com/products/en/resistors/chip-resistor-surface-mount/52?k=&pkeyword=&pv7=2&sf=0&FV=ffec5d6b%2Cffe00034%2C1f140000&quantity=&ColumnSort=0&page=1&stock=1&pageSize=25>; DIGIKEY: 311-1.00KLRCT-ND; MF: Yageo; MPN: RC0603FR-07330RL; VALUE_PART: 1k
R10 = bschulz_passives:R-EU_: RESISTOR, European symbol Digikey Parts: Yageo, 0402 <https://www.digikey.com/products/en/resistors/chip-resistor-surface-mount/52?k=&pkeyword=&sv=0&s=4356&sf=1&FV=-1%7C13%2C7%7C2%2C1291%7C39157%2C1989%7C0%2C-8%7C52%2C3%7C1131%2C3%7C2503&quantity=&ColumnSort=0&page=1&stock=1&pageSize=25> Yageo, 0603 <https://www.digikey.com/products/en/resistors/chip-resistor-surface-mount/52?k=&pkeyword=&sv=0&pv1291=39245&sf=1&FV=-5%7C4356%2C-5%7C47360%2C-8%7C52%2C-1%7C13%2C7%7C2%2C1989%7C0&quantity=10&ColumnSort=1000011&page=1&stock=1&pageSize=25> Panasonic, 0603 <https://www.digikey.com/products/en/resistors/chip-resistor-surface-mount/52?k=&pkeyword=&pv252=68&sf=0&FV=ffec373d%2C1c0002%2C142c040c%2C1f140000%2Cffe00034%2C80002%2Cc0001&quantity=&ColumnSort=0&page=1&stock=1&pageSize=25> Panasonic, precision, 0603 <https://www.digikey.com/products/en/resistors/chip-resistor-surface-mount/52?FV=ffec4907%2Cfffc000a%2Cc0172%2C142c040c%2C1f140000%2Cffe00034%2C1c0002&quantity=100&ColumnSort=2085&page=1&stock=1&pageSize=25> Panasonic, 0805 <https://www.digikey.com/products/en/resistors/chip-resistor-surface-mount/52?k=&pkeyword=&pv3=1&sf=0&FV=ffec373d%2C1c0002%2C1f140000%2Cffe00034%2C142c040d&quantity=&ColumnSort=0&page=1&stock=1&pageSize=25> Rohm, current sense <https://www.digikey.com/products/en/resistors/chip-resistor-surface-mount/52?k=&pkeyword=&pv3=1&sf=0&FV=ffecb688%2C1f140000%2Cffe00034%2C1c0002&quantity=&ColumnSort=0&page=1&stock=1&pageSize=25> Vishay, pulse proof automotive <https://www.digikey.com/products/en/resistors/chip-resistor-surface-mount/52?k=&pkeyword=&pv7=2&sf=0&FV=ffec5d6b%2Cffe00034%2C1f140000&quantity=&ColumnSort=0&page=1&stock=1&pageSize=25>; DIGIKEY: 311-130KHRCT-ND; MF: Yageo; MPN: RC0603FR-07130KL; VALUE_PART: 130k
R19 = bschulz_passives:R-EU_: RESISTOR, European symbol Digikey Parts: Yageo, 0402 <https://www.digikey.com/products/en/resistors/chip-resistor-surface-mount/52?k=&pkeyword=&sv=0&s=4356&sf=1&FV=-1%7C13%2C7%7C2%2C1291%7C39157%2C1989%7C0%2C-8%7C52%2C3%7C1131%2C3%7C2503&quantity=&ColumnSort=0&page=1&stock=1&pageSize=25> Yageo, 0603 <https://www.digikey.com/products/en/resistors/chip-resistor-surface-mount/52?k=&pkeyword=&sv=0&pv1291=39245&sf=1&FV=-5%7C4356%2C-5%7C47360%2C-8%7C52%2C-1%7C13%2C7%7C2%2C1989%7C0&quantity=10&ColumnSort=1000011&page=1&stock=1&pageSize=25> Panasonic, 0603 <https://www.digikey.com/products/en/resistors/chip-resistor-surface-mount/52?k=&pkeyword=&pv252=68&sf=0&FV=ffec373d%2C1c0002%2C142c040c%2C1f140000%2Cffe00034%2C80002%2Cc0001&quantity=&ColumnSort=0&page=1&stock=1&pageSize=25> Panasonic, precision, 0603 <https://www.digikey.com/products/en/resistors/chip-resistor-surface-mount/52?FV=ffec4907%2Cfffc000a%2Cc0172%2C142c040c%2C1f140000%2Cffe00034%2C1c0002&quantity=100&ColumnSort=2085&page=1&stock=1&pageSize=25> Panasonic, 0805 <https://www.digikey.com/products/en/resistors/chip-resistor-surface-mount/52?k=&pkeyword=&pv3=1&sf=0&FV=ffec373d%2C1c0002%2C1f140000%2Cffe00034%2C142c040d&quantity=&ColumnSort=0&page=1&stock=1&pageSize=25> Rohm, current sense <https://www.digikey.com/products/en/resistors/chip-resistor-surface-mount/52?k=&pkeyword=&pv3=1&sf=0&FV=ffecb688%2C1f140000%2Cffe00034%2C1c0002&quantity=&ColumnSort=0&page=1&stock=1&pageSize=25> Vishay, pulse proof automotive <https://www.digikey.com/products/en/resistors/chip-resistor-surface-mount/52?k=&pkeyword=&pv7=2&sf=0&FV=ffec5d6b%2Cffe00034%2C1f140000&quantity=&ColumnSort=0&page=1&stock=1&pageSize=25>; DIGIKEY: 311-100LRCT-ND; MF: Yageo; MPN: RC0402FR-07100RL; VALUE_PART: 100
R22 R23 = bschulz_passives:R-EU_: RESISTOR, European symbol Digikey Parts: Yageo, 0402 <https://www.digikey.com/products/en/resistors/chip-resistor-surface-mount/52?k=&pkeyword=&sv=0&s=4356&sf=1&FV=-1%7C13%2C7%7C2%2C1291%7C39157%2C1989%7C0%2C-8%7C52%2C3%7C1131%2C3%7C2503&quantity=&ColumnSort=0&page=1&stock=1&pageSize=25> Yageo, 0603 <https://www.digikey.com/products/en/resistors/chip-resistor-surface-mount/52?k=&pkeyword=&sv=0&pv1291=39245&sf=1&FV=-5%7C4356%2C-5%7C47360%2C-8%7C52%2C-1%7C13%2C7%7C2%2C1989%7C0&quantity=10&ColumnSort=1000011&page=1&stock=1&pageSize=25> Panasonic, 0603 <https://www.digikey.com/products/en/resistors/chip-resistor-surface-mount/52?k=&pkeyword=&pv252=68&sf=0&FV=ffec373d%2C1c0002%2C142c040c%2C1f140000%2Cffe00034%2C80002%2Cc0001&quantity=&ColumnSort=0&page=1&stock=1&pageSize=25> Panasonic, precision, 0603 <https://www.digikey.com/products/en/resistors/chip-resistor-surface-mount/52?FV=ffec4907%2Cfffc000a%2Cc0172%2C142c040c%2C1f140000%2Cffe00034%2C1c0002&quantity=100&ColumnSort=2085&page=1&stock=1&pageSize=25> Panasonic, 0805 <https://www.digikey.com/products/en/resistors/chip-resistor-surface-mount/52?k=&pkeyword=&pv3=1&sf=0&FV=ffec373d%2C1c0002%2C1f140000%2Cffe00034%2C142c040d&quantity=&ColumnSort=0&page=1&stock=1&pageSize=25> Rohm, current sense <https://www.digikey.com/products/en/resistors/chip-resistor-surface-mount/52?k=&pkeyword=&pv3=1&sf=0&FV=ffecb688%2C1f140000%2Cffe00034%2C1c0002&quantity=&ColumnSort=0&page=1&stock=1&pageSize=25> Vishay, pulse proof automotive <https://www.digikey.com/products/en/resistors/chip-resistor-surface-mount/52?k=&pkeyword=&pv7=2&sf=0&FV=ffec5d6b%2Cffe00034%2C1f140000&quantity=&ColumnSort=0&page=1&stock=1&pageSize=25>; DIGIKEY: 311-10.0KHRCT-ND; MF: Yageo; MPN: RC0603FR-0710KL; VALUE_PART: 10k
R24 = bschulz_passives:R-EU_: RESISTOR, European symbol Digikey Parts: Yageo, 0402 <https://www.digikey.com/products/en/resistors/chip-resistor-surface-mount/52?k=&pkeyword=&sv=0&s=4356&sf=1&FV=-1%7C13%2C7%7C2%2C1291%7C39157%2C1989%7C0%2C-8%7C52%2C3%7C1131%2C3%7C2503&quantity=&ColumnSort=0&page=1&stock=1&pageSize=25> Yageo, 0603 <https://www.digikey.com/products/en/resistors/chip-resistor-surface-mount/52?k=&pkeyword=&sv=0&pv1291=39245&sf=1&FV=-5%7C4356%2C-5%7C47360%2C-8%7C52%2C-1%7C13%2C7%7C2%2C1989%7C0&quantity=10&ColumnSort=1000011&page=1&stock=1&pageSize=25> Panasonic, 0603 <https://www.digikey.com/products/en/resistors/chip-resistor-surface-mount/52?k=&pkeyword=&pv252=68&sf=0&FV=ffec373d%2C1c0002%2C142c040c%2C1f140000%2Cffe00034%2C80002%2Cc0001&quantity=&ColumnSort=0&page=1&stock=1&pageSize=25> Panasonic, precision, 0603 <https://www.digikey.com/products/en/resistors/chip-resistor-surface-mount/52?FV=ffec4907%2Cfffc000a%2Cc0172%2C142c040c%2C1f140000%2Cffe00034%2C1c0002&quantity=100&ColumnSort=2085&page=1&stock=1&pageSize=25> Panasonic, 0805 <https://www.digikey.com/products/en/resistors/chip-resistor-surface-mount/52?k=&pkeyword=&pv3=1&sf=0&FV=ffec373d%2C1c0002%2C1f140000%2Cffe00034%2C142c040d&quantity=&ColumnSort=0&page=1&stock=1&pageSize=25> Rohm, current sense <https://www.digikey.com/products/en/resistors/chip-resistor-surface-mount/52?k=&pkeyword=&pv3=1&sf=0&FV=ffecb688%2C1f140000%2Cffe00034%2C1c0002&quantity=&ColumnSort=0&page=1&stock=1&pageSize=25> Vishay, pulse proof automotive <https://www.digikey.com/products/en/resistors/chip-resistor-surface-mount/52?k=&pkeyword=&pv7=2&sf=0&FV=ffec5d6b%2Cffe00034%2C1f140000&quantity=&ColumnSort=0&page=1&stock=1&pageSize=25>; DIGIKEY: CRT0603-BY-1002ELFCT-ND; MF: Bourns; MPN: CRT0603-BY-1002ELF; VALUE_PART: 10k
R31 R32 = bschulz_passives:R-EU_: RESISTOR, European symbol Digikey Parts: Yageo, 0402 <https://www.digikey.com/products/en/resistors/chip-resistor-surface-mount/52?k=&pkeyword=&sv=0&s=4356&sf=1&FV=-1%7C13%2C7%7C2%2C1291%7C39157%2C1989%7C0%2C-8%7C52%2C3%7C1131%2C3%7C2503&quantity=&ColumnSort=0&page=1&stock=1&pageSize=25> Yageo, 0603 <https://www.digikey.com/products/en/resistors/chip-resistor-surface-mount/52?k=&pkeyword=&sv=0&pv1291=39245&sf=1&FV=-5%7C4356%2C-5%7C47360%2C-8%7C52%2C-1%7C13%2C7%7C2%2C1989%7C0&quantity=10&ColumnSort=1000011&page=1&stock=1&pageSize=25> Panasonic, 0603 <https://www.digikey.com/products/en/resistors/chip-resistor-surface-mount/52?k=&pkeyword=&pv252=68&sf=0&FV=ffec373d%2C1c0002%2C142c040c%2C1f140000%2Cffe00034%2C80002%2Cc0001&quantity=&ColumnSort=0&page=1&stock=1&pageSize=25> Panasonic, precision, 0603 <https://www.digikey.com/products/en/resistors/chip-resistor-surface-mount/52?FV=ffec4907%2Cfffc000a%2Cc0172%2C142c040c%2C1f140000%2Cffe00034%2C1c0002&quantity=100&ColumnSort=2085&page=1&stock=1&pageSize=25> Panasonic, 0805 <https://www.digikey.com/products/en/resistors/chip-resistor-surface-mount/52?k=&pkeyword=&pv3=1&sf=0&FV=ffec373d%2C1c0002%2C1f140000%2Cffe00034%2C142c040d&quantity=&ColumnSort=0&page=1&stock=1&pageSize=25> Rohm, current sense <https://www.digikey.com/products/en/resistors/chip-resistor-surface-mount/52?k=&pkeyword=&pv3=1&sf=0&FV=ffecb688%2C1f140000%2Cffe00034%2C1c0002&quantity=&ColumnSort=0&page=1&stock=1&pageSize=25> Vishay, pulse proof automotive <https://www.digikey.com/products/en/resistors/chip-resistor-surface-mount/52?k=&pkeyword=&pv7=2&sf=0&FV=ffec5d6b%2Cffe00034%2C1f140000&quantity=&ColumnSort=0&page=1&stock=1&pageSize=25>; DIGIKEY: 311-5.10KLRCT-ND; MF: Yageo; MPN: RC0402FR-075K1L; VALUE_PART: 5.1k
RTC1 = bschulz:DS3231M: DS3231M Real Time Clock Accuracy +/-5ppm. Battery Backup. 2.3V to 5.5V. Datasheet <https://cdn.sparkfun.com/datasheets/Dev/Beagle/DS3231M.pdf> SparkFun Products CryptoCape <https://www.sparkfun.com/products/12773> (DEV-12773) SparkFun CryptoShield <https://www.sparkfun.com/products/13183> (DEV-13183); DIGIKEY: DS3231MZ+-ND; MF: Maxim; MPN: DS3231MZ+
S1 S2 = bschulz:BUTTON: Genaric SPST Push button; DIGIKEY: CKN10504CT-ND; MF: C&K; MPN: PTS810 SJG 250 SMTR LFS
U1 = bschulz:ATMEGA1284*: 8-bit Microcontroller with 128K Bytes In-System Programmable Flash Source: http://www.atmel.com/dyn/resources/prod_documents/doc2593.pdf; DIGIKEY: ATMEGA1284P-MURCT-ND; MF: Atmel; MPN: ATMEGA1284P-MUR
U2 = bschulz:FT231X: FT231x - USB to UART Bridge Characteristics: Vin: 3.3V ~ 5V Operating Temperature: -40°C to 85°C Digikey: FT231x <https://www.digikey.com/product-detail/en/ftdi-future-technology-devices-international-ltd/FT231XQ-R/768-1128-1-ND/3029153>; DIGIKEY: 768-1128-1-ND; MF: FTDI; MPN: FT231XQ-R
U3 = bschulz:TPL5010: TPL5010 - Nano-Power System Timer with Watchdog Functionality Characteristics: Vdd: 1.8V ~ 5.5V IQ: 35nA (typ) Period: 100ms ~ 7200 s Operating Temperature: -40°C to 85°C Digikey: 296-38829-1-ND <https://www.digikey.com/product-detail/en/texas-instruments/TPL5010DDCT/296-38829-1-ND/5130149>; DIGIKEY: 296-38829-1-ND; MF: TI; MPN: TPL5010DDCT
U4 = bschulz:SN74LVC1G3157: SN74LVC1G3157 - SPDT Analog Switch Characteristics: VCC: 1.65~5.5V Operating Temperature: -40°C to 85°C On state resistace: 15 Ω, Max Channel to Channel Matching: 0.1 Ω, Typical Digikey: 296-14909-1-ND (SC70, DCK) <https://www.digikey.com/product-detail/en/texas-instruments/SN74LVC1G3157DCKR/296-14909-1-ND/562526> 296-18015-1-ND (SOT-666, DRL) <https://www.digikey.com/product-detail/en/texas-instruments/SN74LVC1G3157DRLR/296-18015-1-ND/770530>; DIGIKEY: 296-14909-1-ND; DISP: SN74LVC1G3157; MF: TI; MPN: SN74LVC1G3157DCKR
U5 = bschulz:SN74AUP3G34: SN74AUP3G34 - Logic Buffer Characteristics: VCC: 0.8~3.6V Operating Temperature: -40°C to 85°C Number of Gates: 3 /li> Inverting: No Digikey: 296-27503-1-ND (UQFN, RSE) <https://www.digikey.com/scripts/DkSearch/dksus.dll?Detail&itemSeq=257211059&uq=636588853324239862> 296-36973-1-ND (XFDFN, DQE) <https://www.digikey.com/product-detail/en/texas-instruments/SN74AUP3G34DQER/296-36973-1-ND/4428921> 296-25595-1-ND (VFSOP, DCU) <https://www.digikey.com/product-detail/en/texas-instruments/SN74AUP3G34DCUR/296-25595-1-ND/2202056>; DIGIKEY: 296-25595-1-ND; MF: TI; MPN: SN74AUP3G34DCUR
U6 = bschulz:TPS797*: TPS797* - Ultra Low Power Low Dropout Linear Regulator Characteristics: Vin: 1.4V ~ 5.5V Vout: 1.8, 2.85, 3.0, 3.3V fixed IQ: 1.2μA typ, 2μA max Voltage Accuracy: 4% max Dropout Voltage: 105mV @ 10mA Output Current: 50 mA Operating Temperature: -40°C to 85°C Digikey: TPS79733 (3.3V Fixed) <https://www.digikey.com/product-detail/en/texas-instruments/TPS79733DCKR/296-11990-1-ND/390520> TPS79730 (3.0V Fixed) <https://www.digikey.com/product-detail/en/texas-instruments/TPS79730DCKR/296-11989-1-ND/390518> TPS797285 (2.85V Fixed) <https://www.digikey.com/product-detail/en/texas-instruments/TPS797285DCKR/296-25465-1-ND/2187585> TPS79718 (1.8V Fixed) <https://www.digikey.com/product-detail/en/texas-instruments/TPS79718DCKR/296-11988-1-ND/390516>; DIGIKEY: 296-11990-1-ND; DISP: TPS79733; MF: TI; MPN: TPS79733DCKR
U7 = bschulz:TPS7A05*: TPS7A05* - Ultra Low Power Low Dropout Linear Regulator Characteristics: Vin: 1.4V ~ 5.5V Vout: 0.8, 1.0, 1.2, 1.5, 1.8, 2.5, 2.85, 3.3V fixed IQ: 1μA typ, 3μA max Voltage Accuracy: 1% typ, 3% max Output Current: 200 mA Operating Temperature: -40°C to 125°C Mouser: TPS7A0533 (3.3V Fixed) <https://www.mouser.com/ProductDetail/Texas-Instruments/TPS7A0533PDBVR?qs=sGAEpiMZZMsGz1a6aV8DcD1rpA6FsR3J1Mp5DdTpiXw%3d> TPS7A0518 (1.8V Fixed) <https://www.mouser.com/ProductDetail/Texas-Instruments/TPS7A0518PDBVR?qs=sGAEpiMZZMsGz1a6aV8DcD1rpA6FsR3J1f7DNYacdSI%3d>; DIGIKEY: 296-50256-1-ND; MF: TI; MOUSER: 595-TPS7A0533PDBVR; MPN: TPS7A0533PDBVR
U8 = bschulz:TPS22916: TPS22916 - Ultra Low Leakage Load Switch Characteristics: Vin: 1v ~ 5.5v IQ: 10nA (OFF), 0.5μA (ON) RDS(ON): 60mΩ (Vin = 5v), 100mΩ (Vin = 1.8v) Output Current: 2A Operating Temperature: -40°C to 125°C Digikey: 296-47464-1-ND (TPS22916CYFPT) <https://www.digikey.com/product-detail/en/texas-instruments/TPS22916CYFPT/296-47464-1-ND/7896953>; DIGIKEY: 296-47464-1-ND; MF: TI; MPN: TPS22916CYFPT
U9 = bschulz:TPS210*: TPS210x - Power Distribution Switch (OR'ing switch) Characteristics: Vin: 2.7V ~ 5.5V Iout: 500mA (In1), 100mA (In2) Ron: 250mΩ (In1), 1.3 Ω (In2) Switch Topology: 2:1 IQ: 0.75μA typ, 18μA max Operating Temperature: -40°C to 85°C TPS2104/5 Inverted vs non-inverted enable pin Digikey: TPS2105 296-10883-1-ND <https://www.digikey.com/product-detail/en/texas-instruments/TPS2105DBVR/296-10883-1-ND/504485> TPS2104 296-10882-1-ND <https://www.digikey.com/product-detail/en/texas-instruments/TPS2104DBVR/296-10882-1-ND/560870>; DIGIKEY: 296-TPS2104DBVTCT-ND; DISP: TPS2104; MF: TI; MPN: TPS2104DBVT
U10 = bschulz:TLV3691: TLV3691 - Nanopower Analog Comparator Characteristics: Vin: 0.9V ~ 6.5V (± 0.45V ~ ± 3.25V) Response Time: 24us Push-Pull Output IQ: 75nA Operating Temperature: -40°C to 125°C Digikey: 296-37910-1-ND (DCK) <https://www.digikey.com/products/en/integrated-circuits-ics/linear-comparators/692?k=TLV3691&k=&pkeyword=TLV3691&sv=0&pv7=2&sf=0&FV=142c0371%2Cffe002b4&quantity=&ColumnSort=1000011&page=1&stock=1&pageSize=25> 296-37242-6-ND (DPF) <https://www.digikey.com/product-detail/en/texas-instruments/TLV3691IDPFR/296-37242-6-ND/4695352>; DIGIKEY: 296-37242-6-ND; MF: TI; MPN: TLV3691IDPFR
U11 = bschulz:MIC9409*: MIC9409x - Hight Side Load Switch Characteristics: Vin: 1.7V ~ 5.5V IQ: 0.1μA typ, 1μA max RDS(ON): 130mΩ (Vin = 5v), 140mΩ (Vin = 3.6v) Output Current: 1.2A Operating Temperature: -40°C to 125°C Digikey: 576-3484-1-ND <https://www.digikey.com/products/en/integrated-circuits-ics/pmic-power-distribution-switches-load-drivers/726?k=mic94090&k=&pkeyword=mic94090&pv1291=38&sf=0&FV=ffe002d6%2C1c0002&quantity=&ColumnSort=0&page=1&stock=1&pageSize=25>; DIGIKEY: 576-3484-1-ND; DISP: MIC94090; MF: Microchip; MPN: MIC94090YC6-TR
U12 = bschulz:BME280: BME280 - Combined Digital Humidity and Pressure Sensor Characteristics: Vcc: 1.8V ~ 3.3V Pressure Range: 300 ~ 1100 mBar Pressure Resolution: 0.0015 mBar, max Pressure Accuracy: relative ±0.12 mBar, abs ± 1 mBar Humidity Resolution: 0.008% RH, max Humidity Accuracy: ±3% RH Temperature Resolution: 0.01°C Temperature Accuracy: 0.5°C Operating Temperature: -40°C to 85°C Digikey: 828-1063-1-ND <https://www.digikey.com/product-detail/en/bosch-sensortec/BME280/828-1063-1-ND/6136314>; DIGIKEY: 828-1063-1-ND; DISP: BME280; MF: Bosch; MPN: BME280
U13 = bschulz:MAX6070AAUT*: MAX6070 Low Noise high precision voltage referance; DIGIKEY: MAX6071AAUT18+TCT-ND; MF: Maxim; MPN: MAX6071AAUT18+T
U14 = bschulz:MCP342*: MCP342* - Sigma Delta ADC Characteristics: VCC: 2.7~5.5V Operating Temperature: -40°C to 125°C Number of Inputs: 1 (Differenital) Sample Rate: 15 Samples Per Second Number of Bits: 16 (MCP3425), 18 (MCP3421) Digikey: MCP3421 MCP3425A0T-E/CHCT-ND <https://www.digikey.com/product-detail/en/microchip-technology/MCP3425A0T-E-CH/MCP3425A0T-E-CHCT-ND/1979810> MCP3425 MCP3421A0T-E/CHCT-ND <https://www.digikey.com/product-detail/en/microchip-technology/MCP3421A0T-E-CH/MCP3421A0T-E-CHCT-ND/2183406> MCP3421A1T-E/CHCT-ND <https://www.digikey.com/product-detail/en/microchip-technology/MCP3421A1T-E-CH/MCP3421A1T-E-CHCT-ND/2183407> MCP3421A3T-E/CHCT-ND <https://www.digikey.com/product-detail/en/microchip-technology/MCP3421A3T-E-CH/MCP3421A3T-E-CHCT-ND/2183409>; DIGIKEY: MCP3421A1T-E/CHCT-ND; DISP: MCP3421; MF: Microchip; MPN: MCP3421A1T-E/CH
U$1 = awickert:VDIV_MARGAY; DIGIKEY: DNP; MF: N/A; MPN: N/A
XTAL1 = bschulz:CRYSTAL: Crystal Oscilator 2 Pin quartz crystal oscilators Variants 3.2x1.5mm (Only available in 32.768kHz) <https://www.digikey.com/products/en/crystals-oscillators-resonators/crystals/171?FV=b839bf%2Cb83a33%2C8640001%2C864000f%2C8640003%2C1f140000%2Cmu32.768kHz%7C2150%2Cffe000ab&quantity=10&ColumnSort=1000011&page=1&stock=1&k=crystal&pageSize=25&pkeyword=crystal> 5 x 3.2mm (8MHz ~ 50MHz) <https://www.digikey.com/products/en/crystals-oscillators-resonators/crystals/171?FV=402f3e%2Cb8434d%2C1f140000%2Cffe000ab&quantity=10&ColumnSort=1000011&page=1&stock=1&pageSize=25>; DIGIKEY: XC2103CT-ND; MF: ECS; MPN: ECS-80-18-30-JGN-TR

## Board
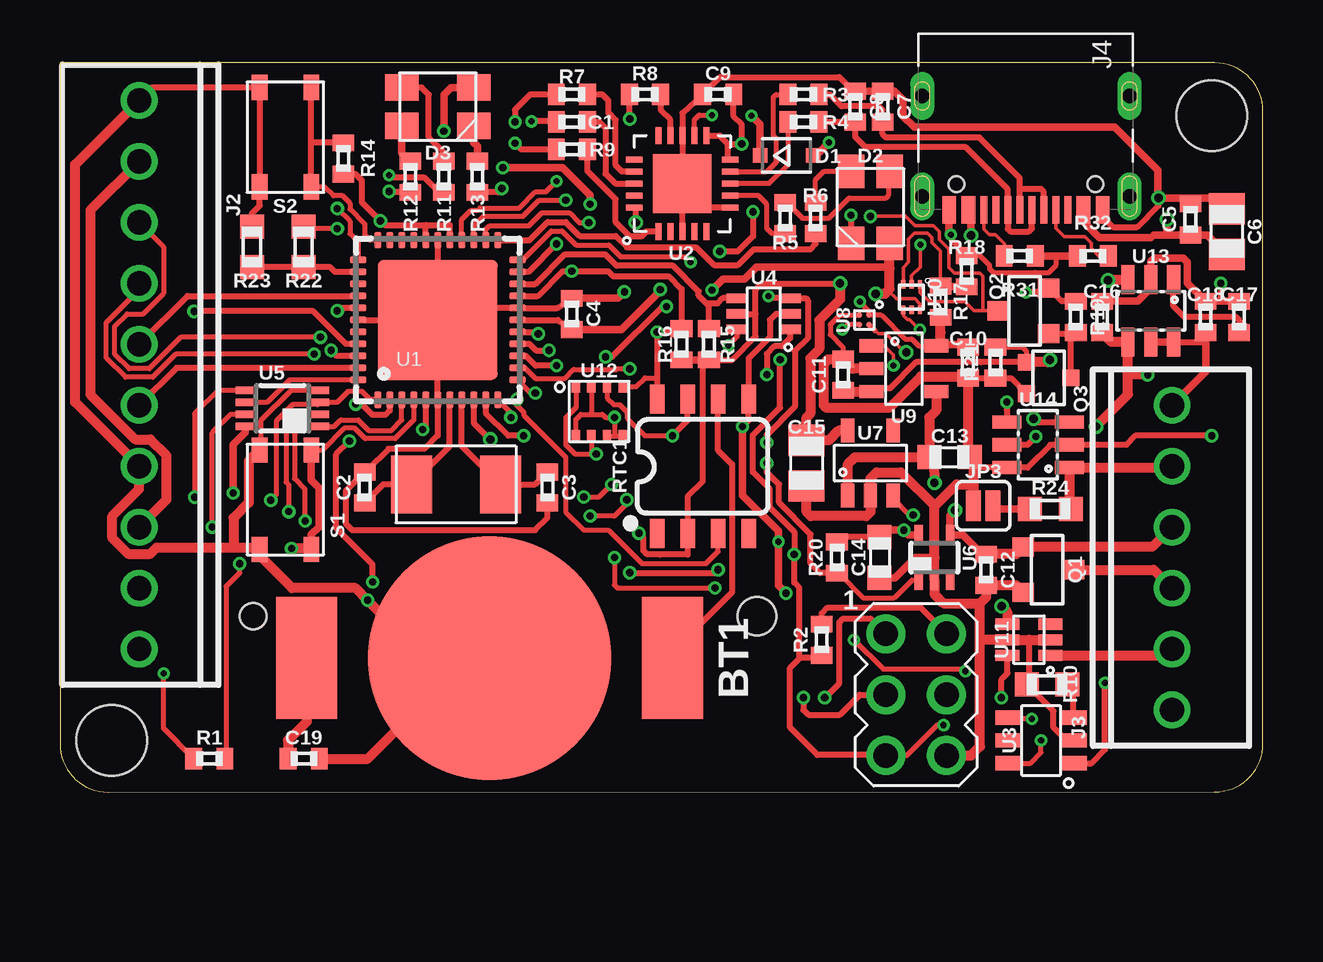
[diagram p3: board, top side]
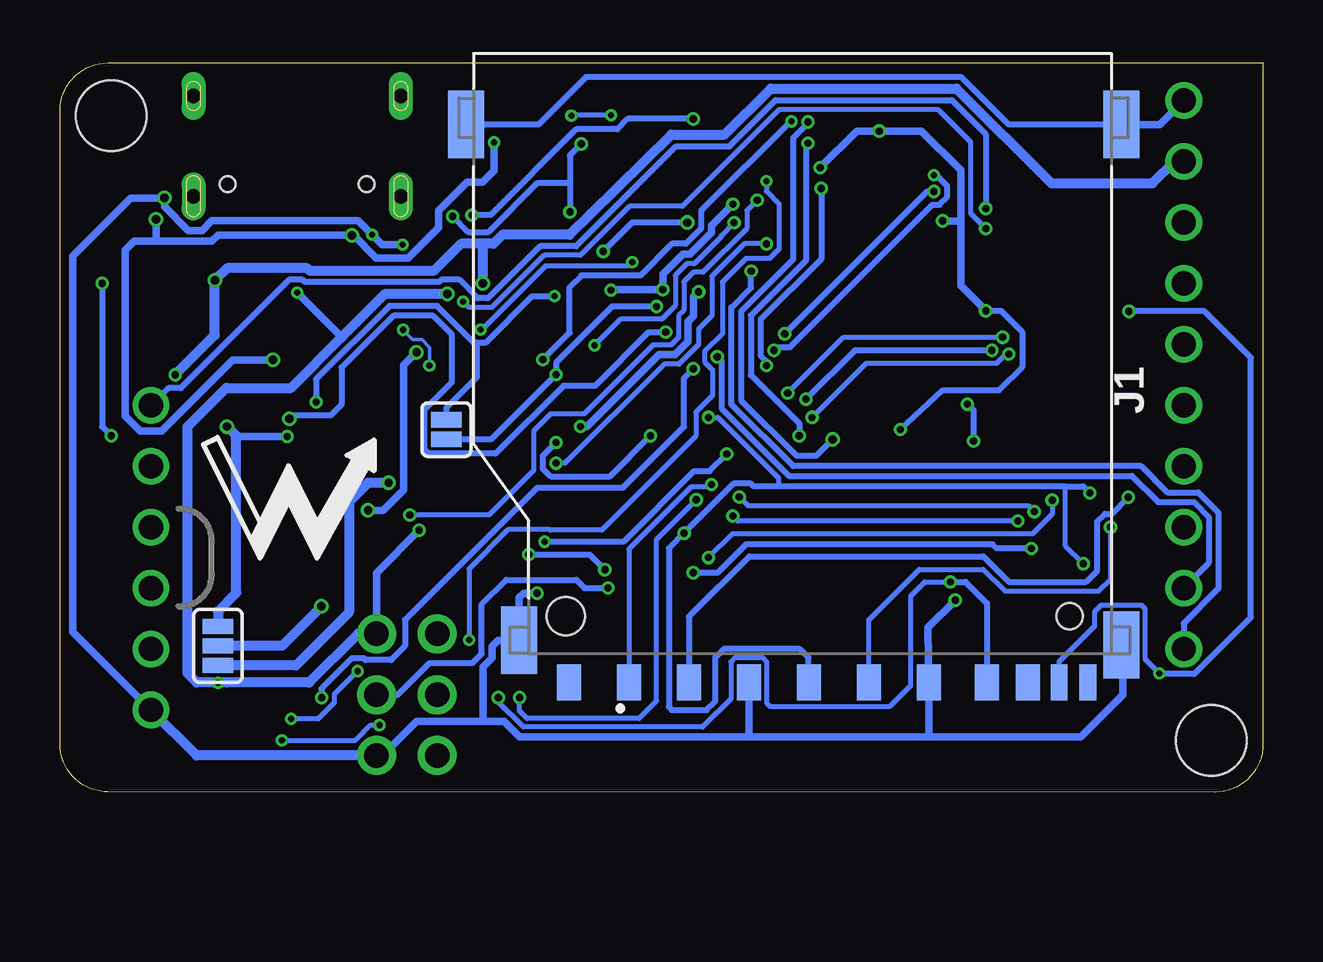
[diagram p4: board, bottom side, seen from below]

Size 50.15 x 30.4 mm. Coordinates in mm from the lower left corner, seen from the top.
Outline: 0,30.4 0,2 arc90 2,0 48.15,0.01 arc90 50.15,2.01 50.15,28.4 arc90 48.15,30.4 0,30.4
Copper layers (1*16): Top 0.035559375mm / dielectric 1.6mm / Bottom 0.035559375mm
Design rules "oshpark-2layer": minimum track width 6mil, minimum drill 10mil, track to track 6mil, track to pad 6mil, pad to pad 6mil, via to via 6mil, smd to smd 6mil, copper to edge 15mil, drill to drill 6mil, minimum pad ring 5mil, minimum via ring 5mil, stop-mask expansion 2.5mil, vias tented up to drill 0mil, thermal gap 10mil
tKeepout: area 0.4,0.4 to 3.9,3.9; area 46.2,26.4 to 49.8,30

### Footprints (pad centres in the part's own frame; a part is rotated, then mirrored left to right if it is on the bottom)
LINX_BAT-HLD-012-SMT = smd 10.16 x 10.16: GND 0,0 | smd 2.54 x 5.08: POWER0 -7.62,0; POWER1 7.62,0
C0402 = smd 0.7 x 0.9: 1 -0.65,0; 2 0.65,0
C0805 = smd 1.3 x 1.5: 1 -0.95,0; 2 0.95,0
C0603 = smd 1 x 1: 1 -0.85,0; 2 0.85,0
SOD323-R = smd 0.6 x 0.6: A 1.1,0; C -1.1,0
CLVBA-FKA = smd 1.4 x 1.1: 1 -1.5,0.8; 2 -1.5,-0.8; 3 1.5,-0.8; 4 1.5,0.8
4_40_CLOSE = hole 2.946: 0,0
AVRISP = drill 1.02 pad 1.626: 1 -1.27,2.54; 2 1.27,2.54; 3 -1.27,0; 4 1.27,0; 5 -1.27,-2.54; 6 1.27,-2.54
SD_WURTH_WR-CRD = smd 1 x 1.5: 1 6.875,0.75; 2 4.375,0.75; 3 1.875,0.75; 4 -0.625,0.75; 5 -3.125,0.75; 6 -5.625,0.75; 7 -8.055,0.75; 8 -9.755,0.75; 9 9.375,0.75 | smd 0.7 x 1.5: CD -11.055,0.75; WP -12.255,0.75 | smd 1.5 x 2.8: GP -13.65,-0.8; GP2 11.45,-1; GP3 13.65,-22.5; GP4 -13.65,-22.5 | hole 1.1: -11.5,-2 | hole 1.6: 9.5,-2
1X10_SCREW = drill 1.016: 1 -11.43,0; 2 -8.89,0; 3 -6.35,0; 4 -3.81,0; 5 -1.27,0; 6 1.27,0; 7 3.81,0; 8 6.35,0; 9 8.89,0; 10 11.43,0
1X06_SCREW = drill 1.016: 1 -6.35,0; 2 -3.81,0; 3 -1.27,0; 4 1.27,0; 5 3.81,0; 6 6.35,0
USB_C_CUSB31-CFM2AX-01-X = smd 0.575 x 1.15: A1B12 -3.2,7.355; A4B9 -2.4,7.355; B1A12 3.2,7.355; B4A9 2.4,7.355 | smd 0.275 x 1.15: A5 -1.25,7.355; A6 -0.25,7.355; A7 0.25,7.355; A8 1.25,7.355; B5 1.75,7.355; B6 0.75,7.355; B7 -0.75,7.355; B8 -1.75,7.355 | drill 0.6 pad 1 long: M1 -4.32,6.78; M2 4.32,6.78; M3 -4.32,2.6; M4 4.32,2.6 | hole 0.65: 2.89,6.28; -2.89,6.28
SMT-JUMPER_2_NO_SILK = smd 0.635 x 1.27: 1 -0.406,0; 2 0.406,0
SMT-JUMPER_3_1-NC_PASTE_SILK = smd 0.635 x 1.27: 1 -0.813,0; 2 0,0; 3 0.813,0
SMT-JUMPER_2_NC_PASTE_SILK = smd 0.635 x 1.27: 1 -0.406,0; 2 0.406,0
SOT23-3 = smd 0.8 x 0.9: 1 -0.95,-1; 2 0.95,-1; 3 0,1.1
SOT23-3@1 = smd 0.8 x 0.9: 1 -0.95,-1; 2 0.95,-1; 3 0,1.1
SOT323 = smd 0.7 x 0.7: 1 -0.65,-0.925; 2 0.65,-0.925; 3 0,0.925
R0402 = smd 0.7 x 0.9: 1 -0.65,0; 2 0.65,0
R0603 = smd 1 x 1: 1 -0.85,0; 2 0.85,0
SO08 = smd 0.6 x 1.2: 1 -1.905,-2.8; 2 -0.635,-2.8; 3 0.635,-2.8; 4 1.905,-2.8; 5 1.905,2.8; 6 0.635,2.8; 7 -0.635,2.8; 8 -1.905,2.8
SWITCH_4.2X3.2 = smd 1.05 x 0.65: 1 -2.075,1.075; 2 2.075,1.075; 3 -2.075,-1.075; 4 2.075,-1.075
MLF44-TH = smd 0.7 x 0.3: 1 -3.325,2.5; 2 -3.325,2; 3 -3.325,1.5; 4 -3.325,1; 5 -3.325,0.5; 6 -3.325,0; 7 -3.325,-0.5; 8 -3.325,-1; 9 -3.325,-1.5; 10 -3.325,-2; 11 -3.325,-2.5; 23 3.325,-2.5; 24 3.325,-2; 25 3.325,-1.5; 26 3.325,-1; 27 3.325,-0.5; 28 3.325,0; 29 3.325,0.5; 30 3.325,1; 31 3.325,1.5; 32 3.325,2; 33 3.325,2.5 | smd 0.3 x 0.7: 12 -2.5,-3.325; 13 -2,-3.325; 14 -1.5,-3.325; 15 -1,-3.325; 16 -0.5,-3.325; 17 0,-3.325; 18 0.5,-3.325; 19 1,-3.325; 20 1.5,-3.325; 21 2,-3.325; 22 2.5,-3.325; 34 2.5,3.325; 35 2,3.325; 36 1.5,3.325; 37 1,3.325; 38 0.5,3.325; 39 0,3.325; 40 -0.5,3.325; 41 -1,3.325; 42 -1.5,3.325; 43 -2,3.325; 44 -2.5,3.325 | smd 5 x 5: TH 0,0
QFN20 = smd 0.7 x 0.25: 1 -2.032,0.968; 2 -2.032,0.468; 3 -2.032,-0.032; 4 -2.032,-0.532; 5 -2.032,-1.032; 11 1.968,-1.032; 12 1.968,-0.532; 13 1.968,-0.032; 14 1.968,0.468; 15 1.968,0.968 | smd 0.25 x 0.7: 6 -1.032,-2.032; 7 -0.532,-2.032; 8 -0.032,-2.032; 9 0.468,-2.032; 10 0.968,-2.032; 16 0.968,1.968; 17 0.468,1.968; 18 -0.032,1.968; 19 -0.532,1.968; 20 -1.032,1.968 | smd 2.45 x 2.45: EP -0.032,-0.032
DDC_R-PDSO-G6 = smd 0.6 x 1.1: 1 -0.95,-1.35; 2 0,-1.35; 3 0.95,-1.35; 4 0.95,1.35; 5 0,1.35; 6 -0.95,1.35
DCK_R-PDSO-G6 = smd 0.4 x 0.9: 1 -0.65,-1.1; 2 0,-1.1; 3 0.65,-1.1; 4 0.65,1.1; 5 0,1.1; 6 -0.65,1.1
DCU_(R-PDSO-G8) = smd 0.3 x 0.8: 1 -0.75,-1.55; 2 -0.25,-1.55; 3 0.25,-1.55; 4 0.75,-1.55; 5 0.75,1.55; 6 0.25,1.55; 7 -0.25,1.55; 8 -0.75,1.55
DCK_R-PDSO-G5 = smd 0.35 x 0.8: 1 -0.65,-0.95; 2 0,-0.95; 3 0.65,-0.95; 4 0.65,0.95; 5 -0.65,0.95
SOT23-5 = smd 0.55 x 1: 1 -0.95,-1.35; 2 0,-1.35; 3 0.95,-1.35; 4 0.95,1.35; 5 -0.95,1.35
YFP0004 = smd 0.23 x 0.23: A1 -0.2,0.2; A2 0.2,0.2; B1 -0.2,-0.2; B2 0.2,-0.2
DPF0006A = smd 0.35 x 0.175: 1 -0.525,0.35; 2 -0.525,0; 3 -0.525,-0.35; 4 0.525,-0.35; 5 0.525,0; 6 0.525,0.35
SC-70_6 = smd 0.47 x 1: 1 -0.65,-0.9; 2 0,-0.9; 3 0.65,-0.9; 4 0.65,0.9; 5 0,0.9; 6 -0.65,0.9
BME280 = smd 0.5 x 0.35: 1 1.025,0.975; 2 1.025,0.325; 3 1.025,-0.325; 4 1.025,-0.975; 5 -1.025,-0.975; 6 -1.025,-0.325; 7 -1.025,0.325; 8 -1.025,0.975
SOT23-6L = smd 0.55 x 1.2: 1 -0.95,-1.3; 2 0,-1.3; 3 0.95,-1.3; 4 0.95,1.3; 5 0,1.3; 6 -0.95,1.3
CRYSTAL_5X3.2_2-SMD = smd 1.7 x 2.4: OSC1 -1.85,0; OSC2 1.85,0

### Placement (x,y rotation side)
BT1  17.91,5.59 180 top
C1  21.34,27.94 180 top
C2  12.7,12.7 270 top
C3  20.32,12.7 90 top
C4  21.34,19.94 90 top
C5  47.12,23.88 90 top
C6  48.64,23.37 90 top
C7  34.29,28.57 270 top
C8  33.15,28.57 270 top
C9  27.43,29.08 180 top
C10  37.85,17.91 270 top
C11  32.64,17.4 90 top
C12  38.61,9.27 270 top
C13  37.08,13.97 0 top
C14  34.16,9.78 270 top
C15  31.11,13.72 270 top
C16  43.43,19.81 90 top
C17  49.15,19.81 90 top
C18  47.75,19.81 90 top
C19  10.16,1.4 0 top
D1  30.29,26.54 0 top
D2  33.78,24.38 90 top
D3  15.75,28.57 180 top
H1  2.16,2.16 0 top
H2  48.01,28.19 0 top
ISP1  35.69,4.06 0 top
J1  19.56,5.33 180 bottom
J2  3.3,17.4 270 top
J3  46.35,9.78 90 top
J4  40.26,31.62 180 top
JP1  34.04,15.11 270 bottom
JP2  43.56,6.1 90 bottom
JP3  38.48,11.94 0 top
Q1  41.15,9.27 270 top
Q2  40.21,20.07 90 top
Q3  41.21,17.27 270 top
R1  6.22,1.4 0 top
R2  31.75,6.35 90 top
R3  30.99,29.08 0 top
R4  30.99,27.94 0 top
R5  30.23,23.94 270 top
R6  31.5,23.94 270 top
R7  21.34,29.08 0 top
R8  24.38,29.08 0 top
R9  21.34,26.8 0 top
R10  41.15,4.5 0 top
R11  16,25.65 90 top
R12  14.61,25.65 90 top
R13  17.4,25.65 90 top
R14  11.81,26.42 270 top
R15  27.05,18.67 270 top
R16  25.91,18.67 270 top
R17  36.7,20.45 270 top
R18  37.8,21.72 270 top
R19  42.34,19.81 270 top
R20  32.38,9.78 90 top
R21  38.99,17.91 90 top
R22  10.16,22.73 90 top
R23  8,22.73 270 top
R24  41.27,11.81 0 top
R31  40.01,22.35 180 top
R32  43.05,22.35 0 top
RTC1  26.8,13.59 0 top
S1  9.4,12.19 90 top
S2  9.4,27.3 90 top
U1  15.75,19.68 90 top
U2  25.91,25.4 90 top
U3  40.89,2.16 90 top
U4  29.34,19.94 90 top
U5  9.27,16 90 top
U6  36.45,9.78 0 top
U7  33.78,13.72 0 top
U8  33.53,19.68 270 top
U9  35.18,17.65 270 top
U10  35.5,20.64 270 top
U11  40.39,6.35 90 top
U12  22.48,15.88 90 top
U13  45.47,20.07 180 top
U14  40.77,14.48 90 top
U$1  41.4,17.65 90 top
U$2  [NWLOGO_MED]  40.64,12.7 0 bottom
XTAL1  16.51,12.83 180 top

### Tracks (layer width: path | path; a pad name or v marks a point on that pad's centre or on a via)
3V3  (via drill 0.25, 0.3, 0.35)
  Top 0.152: 34.52,20.91 34.86,20.57 35.63,20.57 35.85,20.35 U10.6
  Top 0.254: U1.17 20.74,19.68 C4.1 | U1.38 11.68,20.18 v11.56,20.07 | U1.5 15.25,15.25 v15.11,15.11 | ISP1.2 35.87,7.7 32,7.7 31.75,7.45 R2.2 | C14.1 32.59,10.63 R20.2 | R14.2 12.32,25.77 12.59,25.49 12.59,24.58 v13.36,23.81 13.53,23.64 15.25,23.64 | 15.25,23.64 16.25,23.64 U1.27 | U1.29 15.25,23.64 | U3.1 42.99,1.21 43.56,1.78 v43.56,4.56 | R19.1 41.76,20.46 Q2.2
  Top 0.305: v27.18,20.93 27.63,21.39 28.53,21.39 29.02,21.88 34.55,21.88 34.58,21.84 | C14.1 34.46,10.92 v35.18,10.92 35.37,10.73 U6.5 | C4.1 23.41,19.29 25.02,20.89 v25.02,20.95 | D3.2 16.29,29.38 16,29.08 v16,27.56 | v22.1,24.51 22.1,24.89 20.95,26.04 v18.46,26.04 | Q2.2 41.02,20.83 v40.26,20.83
  Top 0.406: v34.01,20.78 34.39,20.78 34.52,20.91 34.58,20.98 34.58,21.84 D2.2
  Bottom 0.254: v15.11,15.11 13.34,16.76 11,16.76 10.03,17.72 10.03,19.18 10.92,20.07 v11.56,20.07 | v43.56,4.56 43.19,4.56 43.18,4.57
  Bottom 0.305: v35.18,10.92 36.96,9.14 ISP1.2 | v27.18,20.93 27.16,20.95 v25.02,20.95 25.02,21.59 24.18,22.43 23.88,22.43 22.98,23.32 22.98,23.62 v22.1,24.51 | v18.46,26.04 16.94,27.56 v16,27.56 14.23,27.56 12.6,25.93 12.6,23.88 | v11.56,20.07 12.6,21.11 12.6,23.88 | v13.36,23.81 12.66,23.81 12.6,23.88 | v40.26,20.83 38.4,18.97
  Bottom 0.406: ISP1.2 37.72,6.6 39.75,4.57 43.18,4.57 44.45,4.57 44.83,4.95 44.83,15.24 43.22,16.86 40.51,16.86 38.4,18.97 36.59,20.78 v34.01,20.78
3V3_AUX  (via drill 0.3, 0.35)
  Top 0.2: v7.49,9.53 7.49,9.14 6.93,8.58 6.93,1.45 R1.2 | U12.8 21.5,15.54 21.72,15.75 22.1,15.75 | 22.1,15.75 22.61,15.75 22.73,15.62 v23.11,15.62 23.11,14.85 | U12.6 23.11,14.85 | 23.11,14.85 U12.5 | U12.2 22.15,15.8 22.1,15.75
  Top 0.254: v40.67,14.83 40.33,14.48 U14.5 | 28.16,19.94 U4.5 29,19.94 | 26.8,18.02 26.8,12.95 26.16,12.32 RTC1.2 26.16,9.91 25.02,9.91 24.48,9.91 24.31,10.07 24.31,10.61 v24.13,10.79 | v32.51,21.21 29.25,21.21 29,20.96 29,19.94 | R15.2 28.01,18.02 29,19.01 29,19.94
  Top 0.305: R15.2 26.8,18.02 R16.2 | v7.22,12.47 7.22,14.49 7.72,15 U5.8
  Top 0.406: U7.5 32.45,15.07 32.05,14.67 C15.1 31.11,15.62 31.27,15.78 31.27,18.09 31.65,18.47 31.65,19.68 32.51,20.54 v32.51,21.21 | J2.8 4.45,12.19 4.45,14.03 3.77,14.71 3.14,14.71 1.27,16.58 1.27,24.26 J2.2 | C16.1 43.83,18.77 U13.4 44.52,17.4 | U13.3 44.49,21.34 v43.69,21.34 | v43.18,15.24 44.52,16.58 44.52,17.4 | v45.34,17.4 44.52,17.4
  Bottom 0.2: v23.11,15.62 22.73,15.62 20.19,13.09 20.19,12.75 | 8.26,12.75 8.26,10.29 v7.49,9.53
  Bottom 0.254: J1.4 18.95,5.61 19.3,5.97 22.48,5.97 22.82,5.62 22.82,3.79 23.19,3.43 24.64,3.43 24.77,3.56 24.77,10.16 v24.13,10.79 22.06,12.86 21.35,12.86 21.23,12.75 20.19,12.75 8.26,12.75 7.49,12.75 v7.22,12.47
  Bottom 0.305: v40.67,14.83 42.77,14.83
  Bottom 0.406: 42.8,14.86 42.8,8.31 43.56,7.54 JP2.3 | J2.2 3.7,26.29 4.61,25.38 8.82,25.38 12.77,29.33 20.52,29.33 22.44,27.41 24.66,27.41 28.04,24.11 28.91,23.24 31.71,23.24 32.08,22.87 32.51,22.87 | 42.8,14.86 v43.18,15.24 | 42.77,14.83 42.8,14.86 | v45.34,17.4 43.69,19.05 v43.69,21.34 43.18,21.84 39.84,21.84 39.74,21.75 34.55,21.75 33.42,22.87 32.51,22.87 | v32.51,21.21 32.51,22.87
3V3_AUX_CTRL  (via drill 0.3)
  Top 0.2: U1.25 17.25,23.6 17.65,24 19.3,24 19.98,24.68 v21.08,24.68 | v35.56,11.56 35.41,11.56 34.73,12.24 U7.3
  Bottom 0.2: v21.08,24.68 21.52,24.24 21.52,23.5 23.34,21.67 23.75,21.67 24.14,21.28 24.14,20.08 24.36,19.86 24.36,18.96 24.67,18.65 25.42,18.65 28.3,15.77 29.69,15.77 30.4,15.06 30.4,13.41 32.26,11.56 v35.56,11.56
3V3_FTDI  (via drill 0.3, 0.35)
  Top 0.152: v33.78,24 35.25,24 35.64,23.61 36.41,23.61 36.65,23.37 36.65,23.04 37.06,22.63 37.06,21.87 37.28,21.65 38.34,21.65 38.47,21.51 38.47,20.07 38.48,20.07 | U10.1 35.85,20.83 36.23,20.45 37.72,20.45 38.1,20.07 38.48,20.07 | 38.48,20.07 Q2.3
  Top 0.254: U2.11 27.5,27.37 27.84,27.02 | 27.84,27.02 v28.42,27.02 28.42,27.84 28.08,28.18 C9.1 | U2.10 arc-90 27.84,26.46 27.84,27.02 | U2.20 24,24.31 v24,23.74 | v27.5,22.55 28.26,22.55 28.89,23.18 v28.89,24.19
  Bottom 0.254: v33.78,24 33.13,23.35 32.28,23.35 30.23,25.4 28.89,25.4 | v24,23.74 26.3,23.74 v27.5,22.55 | v28.42,27.02 28.89,26.55 28.89,25.4 | 28.89,25.4 v28.89,24.19
_BLUE_RX_AUX_LED
  Top 0.2: 34.54,25.85 34.54,24.89 34.42,24.77 32.89,24.77 32.05,23.92 30.95,23.92 30.29,24.59 R5.1
  Top 0.254: 34.54,25.85 D2.3
_BLUE_STAT_LED
  Top 0.254: R11.2 16,26.67 15.37,27.3 15.37,29.08 15.07,29.38 D3.3
_GREEN_AUX_LED
  Top 0.2: R6.1 31.5,25.53 31.85,25.88 D2.4
_GREEN_STAT_LED
  Top 0.305: D3.4 14.25,26.66 R12.2
_RED_STAT_LED
  Top 0.305: R13.2 17.4,26.92 17.25,27.07 D3.1
_RED_TX_AUX_LED  (via drill 0.3)
  Top 0.254: D2.1 32.97,22.89 v32.97,24.06 | v23.75,28.07 23.73,28.08 R8.1
  Bottom 0.254: v23.75,28.07 26.48,28.07 26.91,27.64 28.62,27.64 32.2,24.06 v32.97,24.06
ADC_EXT_A0
  Top 0.254: U1.37 5.32,20.68 J2.5
AX
  Top 0.406: R24.2 42.07,11.87 U14.1 46.29,13.53 J3.5
BAT_SENSE
  Top 0.254: R23.2 R22.1 11.26,21.88 11.46,21.68 U1.35
BLUE_STAT_LED  (via drill 0.25, 0.3)
  Top 0.254: U1.15 19.57,18.68 19.84,18.41 v20.38,18.41 | R11.1 15.8,25 15.17,25.63 13.81,25.63 v13.72,25.73
  Bottom 0.254: v20.38,18.41 20.25,18.55 19.71,18.55 13.77,24.48 13.49,24.48 13.16,24.81 13.16,25.27 13.49,25.6 13.59,25.6 v13.72,25.73
CC1
  Top 0.152: J4.A5 41.51,23.52 41.87,23.16 42.72,23.16 42.98,22.9 42.98,22.68 43.31,22.35 R32.2
CC2
  Top 0.152: J4.B5 38.51,23.47 38.73,23.24 38.99,23.24 39.35,22.88 R31.2
D+
  Top 0.254: J4.A6 40.51,23.5 40.39,23.37 39.62,23.37 39.51,23.48 J4.B6 39.51,25.13 37.76,26.88 33.57,26.88 33.15,27.3 C8.2 31.65,27.93 R4.2
D-
  Top 0.254: J4.A7 40.01,25.15 | 40.01,25.15 40.01,25.61 38.33,27.29 34.44,27.29 34.29,27.43 C7.2 34.29,28.45 34.14,28.6 32.58,28.6 32.09,29.08 R3.2 | J4.B7 41.01,25.03 40.89,25.15 40.01,25.15
DTR
  Top 0.254: C1.1 22.48,27.94 22.73,27.69 22.73,25.78 23.15,25.37 U2.18
GND  (via drill 0.25, 0.3, 0.35)
  Top 0.152: U10.2 35.5,21.53 35.87,21.9 v35.87,22.83
  Top 0.2: U5.4 9.64,16.75 8.37,15.48 8.37,14.39 8.32,14.39 S1.2 | U12.7 22.15,14.1 v22.35,14.1 21.46,14.1 21.08,14.48 21.08,15.61 21.5,16.03 U12.1 | U8.B1 32.5,19.89 32.11,19.49 32.11,19.07 32.64,18.54 C11.2 | 41.53,22.35 41.53,21.97 41.23,21.67 40.65,21.67 40.63,21.65 38.9,21.65 38.75,21.8 38.75,21.95 38.34,22.37 R18.1
  Top 0.203: C13.2 38.23,13.68 38.23,13.53
  Top 0.254: U2.3 U2.EP | U2.6 26.94,24.37 U2.EP | U2.EP U2.13 25.94,28.31 C9.2 27.51,29.81 32.48,29.81 33.07,29.23 C7.1 C8.1 | U1.TH U1.6 15.75,14.86 15.2,14.31 13.69,14.31 12.83,13.44 12.59,13.44 C2.1 11.92,12.57 11.92,11.18 12.18,10.92 19.81,10.92 20.32,11.43 C3.1 | U1.TH 16.25,20.18 U1.18 20.73,20.18 C4.2 | U1.39 U1.TH | U1.28 U1.TH | v48.01,14.86 44.83,14.86 44.45,14.48 U14.2 41.27,14.48 40.33,13.53 U14.6 38.23,13.53 38.14,13.53 38.08,13.46 | R23.1 8,24.13 8.32,24.45 S2.1 S2.2 3.85,29.38 J2.1 | v28.45,15.24 28.7,15.49 RTC1.5 | 28.83,16.52 RTC1.5 | 41.91,2.16 U3.2 41.95,2.16 41.41,2.69 41.41,3.38 R10.1 40.39,4.61 40.39,6.35 | v48.39,21.21 48.39,20.46 | R18.1 37.8,22.4 37.14,23.06 v37.14,23.24 | J4.A1B12 43.46,23.98 43.88,23.56 44.9,23.56 45.78,24.45 v45.78,24.77 | Q3.2 39.65,17.26 R21.1 C10.2 | U4.2 29.84,19.94 29.59,19.68 29.59,18.97 28.7,18.08 RTC1.5
  Top 0.305: C17.2 48.39,20.46 C18.2 47,21.22 47,22.09 46.82,22.27 45.61,22.27 45.47,22.13 U13.2 45.47,21.01 44.92,20.46 44.12,20.46 44.11,20.46 C16.2 | v28.45,15.24 28.45,12.37 29.94,10.88 v29.94,10.44 29.94,8.61 v30.26,8.29 | 36.45,9.78 35.65,9.78 34.8,8.93 C14.2 | v23.52,20.86 23.26,20.59 C4.2 | 43.52,24.27 J4.A1B12 | C8.1 34.78,29.23 35.13,28.87 35.13,28.19 35.61,27.72 43.98,27.72 45.77,25.93 45.77,24.78 v45.78,24.77 47.12,24.77 | C6.2 48.19,24.77 47.12,24.77 | 37.19,24.14 J4.B1A12 37.06,23.31 v37.14,23.24 | C5.2 47.12,24.77 | R31.1 41.53,22.35 R32.1
  Top 0.406: 38.08,12.83 JP3.1 | 36.46,11.92 36.45,11.91 36.45,9.78 U6.2 36.45,8.26 36.83,7.87 38.35,7.87 | 36.46,11.92 37.37,12.83 38.08,12.83 | 7.24,10.2 4.03,10.2 3.77,9.93 2.84,9.93 2.18,10.59 2.18,11.51 3.3,12.63 J2.7 0.64,16.26 0.64,26.16 J2.1 | 7.24,10.2 8.24,10.2 S1.1 8.32,9.86 9.68,8.51 12.32,8.51 v12.83,8 15.24,5.59 BT1.GND 17.02,5.59 12.83,1.4 C19.2 | S1.2 7.87,13.82 7.87,12.06 7.24,11.43 7.24,10.2 | Q1.2 39.85,8.62 C12.2 38.61,8.13 38.35,7.87 | C15.2 31.11,11.68 31.29,11.51 33.61,11.51 33.78,11.68 U7.2 33.78,13.08 34.04,13.34 35.05,13.34 36.46,11.92 | 38.08,13.46 38.08,12.83 | U9.2 33.03,17.65 C11.2 32.02,18.05 31.83,17.86 31.83,16.12 31.91,16.04 34.59,16.04 35.88,17.33 37.77,17.33 C10.2 | ISP1.6 37.97,1.52 38.35,1.91 38.35,6.35 | 38.35,6.35 U11.5 40.39,6.35 U11.2 | 38.35,6.35 38.35,7.87 | C10.2 37.85,17.27 | C10.2 37.85,14.06 C13.2
  Bottom 0.254: v48.39,21.21 48.39,15.24 v48.01,14.86 | v22.35,14.1 23.07,13.38 23.72,13.38 26.66,10.44 v29.94,10.44 | J1.GP4 10.59,27.83 12.57,29.81 28.23,29.81 30.2,27.83 J1.GP3
  Bottom 0.305: v12.83,8 13.96,6.87 13.96,6.73 J1.6 13.93,2.4 13.84,2.31 | ISP1.6 36.7,1.52 35.28,2.95 32.51,2.95 | v28.45,15.24 28.17,15.24 25.17,18.24 24.5,18.24 23.96,18.79 23.96,19.62 23.73,19.85 23.73,20.65 v23.52,20.86 | v35.87,22.83 36.73,22.83 v37.14,23.24 37.72,23.82 43.81,23.82 44.22,23.42 44.79,23.42 45.78,24.41 v45.78,24.77 47.2,24.77 49.61,22.35 49.61,6.69 J3.1 | 21.34,2.31 30.99,2.31 31.62,2.95 32.51,2.95 | 21.34,2.31 13.84,2.31 | 13.84,2.31 7.59,2.31 5.84,4.06 5.84,6.07 J1.GP | J1.3 21.43,2.41 21.34,2.31 | 32.51,2.95 32.51,5.21 32.13,5.59 32.13,6.08 31.88,6.33 J1.GP2 31.01,8.11 30.82,8.29 v30.26,8.29 | J1.GP4 4.3,27.83 J2.1
  Bottom 0.406: ISP1.6 44.45,1.52 J3.1
GPIO_EXT_D0
  Top 0.254: U1.43 4.86,17.68 J2.6
GREEN_AUX_LED
  Top 0.254: U1.23 19.57,23.01 20.32,23.77 21.08,23.77 21.66,23.18 23.16,23.18 23.63,22.72 26.51,22.72 27.25,21.97 28.26,21.97 28.93,22.64 31.27,22.64 31.5,22.86 R6.2
GREEN_STAT_LED  (via drill 0.3)
  Top 0.254: U1.16 19.86,19.18 v19.94,19.1 | R12.1 13.75,25 v13.72,25.04
  Bottom 0.254: v19.94,19.1 14,25.04 v13.72,25.04
LOG_INT
  Top 0.2: S2.3 11.03,25.23 11.4,24.86 11.78,24.86 12.09,24.55 12.09,24.3 12.7,23.69 12.7,23.24 12.93,23.01 U1.33
  Top 0.254: S2.3 10.47,27.05 | 10.47,27.05 S2.4 | R14.1 10.49,27.07 10.47,27.05
MISO  (via drill 0.3)
  Top 0.254: U1.2 13.75,15.91 13.57,15.73 13.03,15.73 12.58,16.17 v12.32,16.17 | v13.03,8.76 13.03,9.5 11.51,11.02 11.51,14.09 v12.06,14.64 | v31.88,3.94 32.48,4.54 32.48,7.08 32.64,7.24 33.78,7.24 ISP1.1
  Bottom 0.2: 13.08,8.76 v13.03,8.76 14.1,8.76 14.69,8.18 14.69,4.45 15.55,3.58 20.55,3.58 20.68,3.71 20.68,5.44 20.83,5.59 22.04,5.59 22.18,5.44 22.18,3.9 23.36,2.72 30.82,2.72 31.88,3.77 v31.88,3.94
  Bottom 0.254: v12.32,16.17 12.06,15.92 v12.06,14.64 | v13.03,8.76 12.4,8.76 11.5,7.87 J1.7
MOSI  (via drill 0.3)
  Top 0.2: U1.1 12.93,16.36 12.59,16.7 12.01,16.7 11.55,16.25 U5.3 10.72,16.15 9.69,16.15 9.02,15.48 9.02,12.4 v8.79,12.17 | v23.11,9.78 23.11,8.64 23.24,8.51 v27.3,8.51
  Bottom 0.2: v23.11,9.78 22.12,10.77 9.61,10.77 8.79,11.6 v8.79,12.17
  Bottom 0.254: ISP1.4 36.07,4.06 34.75,5.38 32.95,5.38 32.56,5.77 32.56,7.82 31.54,8.85 28.62,8.85 28.28,8.51 v27.3,8.51
MOSI_BUF  (via drill 0.3)
  Top 0.2: v5.61,12.29 5.61,15.77 6.59,16.75 U5.5
  Bottom 0.254: v5.61,12.29 6.3,11.61 6.58,11.61 6.91,11.28 6.91,9.22 7.37,8.76 10.59,8.76 11.66,9.83 21.41,9.83 23.88,7.37 23.93,7.31 J1.2
N$2
  Top 0.254: U3.3 42.24,4.25 R10.2
N$3  (via drill 0.35)
  Top 0.406: v39.24,7.75 39.49,7.5 U11.4
  Bottom 0.406: v39.24,7.75 40.89,6.1 JP2.2
N$6
  Top 0.254: Q3.3 42.14,18.96 R19.2 42.3,19.12 Q2.1
N$7  (via drill 0.25)
  Top 0.2: U2.12 26.44,28.03 26.64,28.23 v27.18,28.23
  Top 0.305: D1.C 29.19,26.65 29.18,26.66 29.18,27.85 v28.83,28.19
  Bottom 0.2: v27.18,28.23 28.8,28.23 v28.83,28.19
N$11
  Top 0.254: C17.1 49.15,19.68 49.02,19.81 46.86,19.81 46.42,20.26 U13.1
N$12
  Top 0.152: R18.2 37.67,21.19 | 36.53,21.27 R17.1 36.7,22.56 36.35,22.91 36.35,23.11 36.15,23.31 35.61,23.31 35.36,23.06 35.36,22.09 35.15,21.88 U10.3
  Top 0.305: R18.2 36.73,21.07 R17.1
N$14  (via drill 0.25)
  Top 0.152: U9.1 34.36,18.6 34.75,18.21 v34.75,17.78 | v35.85,19.27 35.41,19.71 35.31,19.71 35.15,19.88 U10.4
  Bottom 0.152: v34.75,17.78 34.75,18.54 34.75,18.55 34.75,18.56 35.06,18.87 35.45,18.87 v35.85,19.27
N$25
  Top 0.254: U2.17 23.42,25.87 23.16,26.13 23.16,28.02 22.86,28.32 22.86,28.83 22.61,29.08 R7.2
N$35
  Top 0.254: 24.13,23.16 24.24,23.16 24.44,23.37 U2.1 | 24.13,23.16 23.76,23.16 | 24.13,23.16 23.76,23.16 | 23.76,23.16 23.16,23.76 23.16,24.72 21.99,25.89 R9.2
N$38
  Top 0.2: R4.1 30.34,26.15 29.56,25.37 U2.8
  Top 0.254: 30.5,27.94 R4.1
N$46
  Top 0.2: U2.9 29.47,25.87 29.87,26.27 29.87,27.25 29.74,27.39 29.74,28.97 29.84,29.08 R3.1
PG  (via drill 0.3)
  Top 0.2: U6.1 35.51,8.83 34.78,8.1 33.47,8.1 32.44,9.13
  Top 0.254: v20.7,22.86 19.53,21.68 U1.21 | 32.44,9.13 R20.1 31.69,9.13 31.29,9.53 31.29,10.75 29.97,12.06 29.97,12.83 29.46,13.34 v29.46,13.72
  Bottom 0.2: 25.11,17.68 24.96,17.84 24.34,17.84 23.53,18.65 23.53,19.31
  Bottom 0.203: v20.7,22.86 21.61,22.86 22.97,21.51 22.97,19.87 23.53,19.31 | v29.46,13.72 29.08,13.72 25.11,17.68
RED_STAT_LED  (via drill 0.3)
  Top 0.254: v18.41,25.17 18.25,25 R13.1 | U1.14 19.42,18.18 19.83,17.78 v20.7,17.78
  Bottom 0.254: v18.41,25.17 18.41,22.23 20.94,19.7 20.94,18.18 20.7,17.95 v20.7,17.78
RST  (via drill 0.25, 0.3)
  Top 0.2: U1.4 14.75,15.51 13.97,14.73 12.72,14.73 12.28,15.17 11.85,15.17 10.94,14.27 S1.4 | U3.6 40.45,1.21 40.89,1.65 v40.89,2.16 | v36.83,2.79 36.58,2.79 35.31,1.52 ISP1.5
  Top 0.254: ISP1.5 34.39,1.55 31.57,1.55 30.43,2.69 30.43,5.18 30.82,5.57 | 30.82,5.57 30.86,5.61 31.64,5.61 R2.1 | 30.82,5.57 30.82,8.52 30.61,8.73 v30.61,9.91 30.61,10.86 29.57,11.9 29.57,12.66 28.88,13.34 28.88,14.88 30.02,16.03 v30.02,18.03 | v23.75,9.14 27.3,9.14 v27.43,9.27 | v19.65,27.96 20.66,27.96 C1.2
  Top 0.305: S1.4 10.47,13.01 10.8,12.69 10.8,11.06 10.47,10.74 S1.3 10.43,10.16
  Top 0.406: 10.43,10.16 v9.65,10.16
  Bottom 0.2: v40.89,2.16 37.83,2.16 37.19,2.79 v36.83,2.79
  Bottom 0.254: v30.61,9.91 28.07,9.91 v27.43,9.27 | v30.02,18.03 28.9,19.15 28.9,21.05 28.41,21.54 25.96,21.54 24.64,22.86 24.05,22.86 23.42,23.5 23.42,24.23 19.68,27.96 v19.65,27.96 | v9.65,10.16 11.1,10.16 11.28,10.34 21.54,10.34 22.73,9.14 v23.75,9.14
RTC_INT  (via drill 0.3)
  Top 0.2: RTC1.3 27.43,10.03 26.93,9.53 24.25,9.53 22.86,10.92 21.84,10.92 21.08,11.68 21.08,13.97 19.32,15.73 19.32,15.84 19.05,16.12 v19.05,16.38
  Top 0.254: U1.42 11.53,18.18 v11.3,18.41
  Bottom 0.254: v11.3,18.41 17.02,18.41 v19.05,16.38
RX  (via drill 0.3, 0.35)
  Top 0.254: U1.9 17.25,15.39 v17.94,14.7 | R7.1 19.6,29.08 18.97,28.45 v18.97,27.94
  Bottom 0.254: v17.94,14.7 18.61,14.02 19.44,14.02 21.75,16.33 21.75,20.04 19.58,22.21 19.58,27.27 18.97,27.88 v18.97,27.94
RX_EXT  (via drill 0.3)
  Top 0.2: U1.11 18.8,15.81 v18.8,15.62 | v10.6,18.26 4.83,18.26 3.87,17.3 2.74,17.3 1.93,18.1 1.93,19.58 3.3,20.95 J2.4
  Bottom 0.2: v10.6,18.26 10.71,18.26 11.08,17.89 16.53,17.89 v18.8,15.62
RX_LED
  Top 0.2: U2.7 29.11,24.87 29.46,24.51 29.46,23.5 29.67,23.29 R5.2
SCK  (via drill 0.3)
  Top 0.2: U1.3 14.25,15.51 13.82,15.08 12.87,15.08 12.43,15.52 11.7,15.52 11.43,15.25 U5.1 10.04,15.25 9.78,14.99 9.78,13.07 10.21,12.64 10.21,11.31 v10.22,11.3 | v23.62,12.19 23.62,12.02 23.11,11.51 v22.1,11.51
  Top 0.254: ISP1.3 33.34,4.06 32.51,3.23 31.19,3.23 30.99,3.43 v30.99,3.94
  Bottom 0.2: v10.22,11.3 21.89,11.3 v22.1,11.51 | v23.62,12.19 25.27,10.54 25.27,3.81 26.01,3.07 30.68,3.07 30.99,3.38 v30.99,3.94
SCK_BUF  (via drill 0.3)
  Top 0.2: v6.35,11.05 6.35,14.99 7.12,15.75 U5.7
  Bottom 0.2: v6.35,11.05 6.35,8.89 6.86,8.38 10.75,8.38 11.66,9.29 14.33,9.29 16.43,7.19 J1.5
SCL  (via drill 0.3, 0.35)
  Top 0.2: U12.4 24.01,16.9 24.38,17.27 24.89,17.27
  Top 0.254: RTC1.8 24.89,17.27 v24.89,19.18 25.91,19.18 R16.1 25.91,20.98 25.38,21.51 23.06,21.51 22.85,21.72 v21.34,21.72 20.95,21.72 19.92,20.68 U1.19 | v40.58,15.56 40.71,15.43 U14.3
  Bottom 0.254: v21.34,21.72 21.34,21.03 22.16,20.21 22.16,16.16 19.58,13.59 5.08,13.59 3.99,12.5 2.7,12.5 1.85,11.65 1.85,8.48 3.3,7.04 J2.10 | v24.89,19.18 25.61,19.18 27.84,16.94 29.16,16.94 31.99,14.11 34.79,14.11 34.95,14.27 34.95,15.95 33.81,17.1 33.81,19.07 34.59,19.86 36.25,19.86 38.41,17.7 38.41,16.16 38.86,15.7 40.44,15.7 v40.58,15.56
SD_CD  (via drill 0.25, 0.3)
  Top 0.2: R1.1 4.32,2.65 v4.32,4.95
  Top 0.254: U1.41 11.92,18.68 10.56,20.05 v5.59,20.05
  Bottom 0.2: v4.32,4.95 4.91,5.54 4.91,7.64 5.05,7.79 6.76,7.79 7.03,7.52 7.03,6.91 8.5,5.43 J1.CD
  Bottom 0.254: v5.59,20.05 2.44,20.05 0.51,18.11 0.51,7.29 2.87,4.93 4.29,4.93 v4.32,4.95
SD_CS
  Top 0.2: U1.44 9.56,17.18 8.63,16.25 U5.6
SD_CS_BUF  (via drill 0.3)
  Top 0.2: U5.2 10.04,15.75 9.43,15.14 9.43,12.92 9.54,12.81 v9.54,11.7 | v21.83,12.31 22.47,12.31 v22.99,12.83
  Bottom 0.2: v22.99,12.83 23.09,12.72 23.84,12.72 26.43,10.13 J1.1 | v9.54,11.7 9.79,11.95 21.47,11.95 v21.83,12.31
SDA
  Top 0.2: U4.4 27.96,20.59
  Top 0.254: 27,19.37 R15.1 27.05,20.27 26.95,20.38 | U1.20 19.81,21.18 21.05,22.43 22.72,22.43 23.2,21.95 25.55,21.95 26.62,20.88 26.62,20.7 26.95,20.38 | U4.4 27.62,20.59 27.41,20.38 26.95,20.38
SDA_CTRL  (via drill 0.25, 0.3)
  Top 0.2: U1.24 17.75,23.45 17.91,23.62 19.56,23.62 20.09,24.15 21.23,24.15 21.64,23.74 v22.05,23.74 | v27.86,18.63 28.24,19 U4.6
  Bottom 0.2: v22.05,23.74 22.58,23.21 22.58,23.15 23.71,22.02 24.01,22.02 24.49,21.55 24.49,20.29 25.06,19.72 26.77,19.72 v27.86,18.63
SDA_EXT  (via drill 0.3)
  Top 0.254: v22.75,18.15 23.01,18.15 25.11,20.25 v25.28,20.25 | U4.1 30.44,18.93 30.1,18.59 29.79,18.59 29.46,18.26 v29.46,17.41
  Bottom 0.254: v25.28,20.25 27.12,20.25 29.46,17.91 v29.46,17.41 32.17,14.71 JP1.2 | J2.9 2.26,9.55 2.26,11.48 2.87,12.09 4.37,12.09 5.46,13.18 19.75,13.18 22.56,15.99 22.56,17.97 v22.75,18.15
SDA_OB  (via drill 0.25, 0.3)
  Top 0.2: U12.3 22.8,16.44 23.09,16.15 23.33,16.15 23.64,15.84 23.64,15.6 24.38,14.86 v25.53,14.86
  Top 0.254: v39.47,16.26 39.47,15.94 U14.4 | RTC1.7 26.16,15.49 v25.53,14.86 | v29.46,14.57 29.46,14.89 30.64,16.07 30.64,18.38 31.17,18.92 31.17,20.51 31.09,20.59 U4.3 29.62,20.59 v29.53,20.68
  Bottom 0.254: v25.53,14.86 27.23,13.16 29.69,13.16 30.02,13.49 30.02,14.02 v29.46,14.57 | v39.47,16.26 39.47,17.21 36.41,20.27 34.43,20.27 32.9,18.75 32.77,18.75 | JP1.1 34.04,16.03 32.77,17.3 32.77,18.75 | 32.77,18.75 32.39,18.75 30.46,20.68 v29.53,20.68
TX  (via drill 0.3)
  Top 0.254: v19.33,14.86 18.69,14.86 17.75,15.8 U1.10 | v18.97,27.05 19.22,26.8 R9.1
  Bottom 0.254: v18.97,27.05 19.05,26.97 19.05,22.16 21.34,19.87 21.34,17.38 19.33,15.37 v19.33,14.86
TX_EXT  (via drill 0.3)
  Top 0.2: U1.12 19.62,16.64 v19.81,16.64 | v10.86,18.97 5.03,18.97 3.72,17.66 2.88,17.66 2.29,18.25 2.29,19.43 2.79,19.94 3.47,19.94 4.32,20.79 4.32,22.73 J2.3
  Bottom 0.2: v19.81,16.64 17.48,18.97 v10.86,18.97
TX_LED
  Top 0.254: U2.14 25.44,28.03 25.03,28.43 R8.2
VBAT+  (via drill 0.35)
  Top 0.152: 33.98,19.23 34.11,19.11 34.42,19.11 35.19,18.34 v35.28,18.34
  Top 0.2: U8.A2 33.98,19.23
  Top 0.305: C12.1 38.24,10.12 37.64,10.73 U6.4 37.1,11.54 v37.3,11.75
  Top 0.406: C12.1 39.85,9.92 Q1.1 45.53,10.22 J3.4
  Bottom 0.305: v37.3,11.75 36.67,11.75 35.81,12.6 35.81,17.81 v35.28,18.34
VBAT-
  Top 0.406: Q1.3 45.59,9.27 J3.3
VBAT_SW  (via drill 0.25, 0.3)
  Top 0.2: v11.56,23.5 10.25,23.5 R22.2 | 36.63,19.1 36.7,19.18 | v33.34,20.45 33.73,20.06 U8.A1 34.24,19.89 35.23,18.89 35.51,18.89 35.8,18.6 U9.5
  Top 0.203: 36.47,19.8 R17.2
  Top 0.305: C10.1 37.75,18.65 36.58,18.65
  Top 0.406: U9.5 36.58,18.65 36.7,18.78 36.7,19.18 R17.2
  Bottom 0.2: v33.34,20.45 33.1,20.21 32.13,20.21 29.97,22.38 28.45,22.38 26.4,24.43 24.2,24.43 20.16,28.47 13.55,28.47 12.2,27.11 12.2,24.13 v11.56,23.5
VBAT_SW_CTRL  (via drill 0.25)
  Top 0.2: U1.22 19.28,22.18 20.48,23.39 20.92,23.39 21.5,22.8 22.88,22.8 23.36,22.32 26.06,22.32 v26.29,22.1 | U8.B2 32.82,19.48 v32.61,19.28
  Bottom 0.2: v26.29,22.1 26.46,21.93 29.91,21.93 32.56,19.28 v32.61,19.28
VCOIN+
  Top 0.254: RTC1.6 27.43,14.24 28.01,13.66 28.01,8.33 25.53,5.84 BT1.POWER0
  Top 0.406: BT1.POWER1 10.29,2.94 9.51,2.16 C19.1
VDIV_AX
  Top 0.305: R24.1 39.01,11.81 JP3.2
VMAIN  (via drill 0.35)
  Top 0.406: U9.4 36.53,15.92 36.23,15.62 C13.1 | U7.1 32.83,13.65 33.15,13.97 C13.1 | C13.1 36.42,13.78 v36.45,12.89
  Bottom 0.406: v36.45,12.89 37.31,12.89 38.1,12.1 38.1,7.49 40.31,5.28 JP2.1
VREF  (via drill 0.3)
  Top 0.2: v11.56,24.33 12.09,23.8 12.09,23.28 12.42,22.94 U1.34
  Top 0.254: U13.6 47.59,18.77 47.75,18.92
  Top 0.305: U13.5 U13.6 | C18.1 47.75,18.92 47.75,17.53 J3.6
  Bottom 0.254: v11.56,24.33 11.56,27.43 12.97,28.85 20.32,28.85 22.24,26.93 24.46,26.93 28.63,22.76 30.14,22.76 32.3,20.59 32.73,20.59 33.5,21.36 34.25,21.36 34.35,21.26 39.94,21.26 40.04,21.36 40.59,21.36 45.11,16.84 45.64,16.84 J3.6
VSWITCH
  Top 0.406: U11.1 46.09,5.7 J3.2
VSWITCH_CTRL  (via drill 0.3)
  Top 0.2: U1.13 19.39,17.68 19.82,17.25 21.05,17.25 21.42,17.62 23.22,17.62 23.25,17.65 v23.75,17.65
  Top 0.254: v39.24,3.94 39.24,4.7 39.5,4.95 U11.6
  Bottom 0.254: v23.75,17.65 24.13,17.27 24.13,15.24 26.67,12.7 30.25,12.7 35.76,7.18 35.76,6.09 36.34,5.51 37.41,5.51 37.48,5.58 37.98,5.58 39.24,4.32 v39.24,3.94
VUSB  (via drill 0.25, 0.35)
  Top 0.2: R21.2 40.12,18.56 40.29,18.39 Q3.1
  Top 0.254: U9.3 33.97,16.84 34.61,16.84 35.69,17.92 38.41,17.92 | Q3.1 38.41,17.92 | 38.41,17.92
  Top 0.305: J4.A4B9 42.66,23.77 43.33,23.11 45.47,23.11 45.59,23.23 46.1,23.23 | J4.B4A9 37.97,24.15 v37.97,23.22 | C6.1 47.83,23.23 C5.1 46.1,23.23 | v46.14,23.88 46.14,23.26 46.1,23.23 | v32.05,27.08 31.51,26.54 D1.A
  Top 0.406: C11.1 32.69,16.7 U9.3 | v41.26,18.02 41.16,17.92 Q3.1
  Bottom 0.305: v41.26,18.02 42.95,18.02 45.91,15.06 46.8,15.06 47.42,15.69 47.42,22.59 47.05,22.96 46.1,22.96 | 46.1,22.96 43.81,22.96 43.56,23.22 v37.97,23.22 37.91,23.22 36.96,22.27 35.63,22.27 34.36,23.54 34.36,24.24 33.18,25.43 32.53,25.43 32.05,25.91 v32.05,27.08 | v46.14,23.88 46.14,23 46.1,22.96
WD_HOLD  (via drill 0.25)
  Top 0.2: U1.26 16.75,23.86 17.14,24.26 17.41,24.26 17.51,24.36 19.16,24.36 19.83,25.03 20.25,25.03 v20.7,25.48 | v33.1,6.35 34.32,5.13 37.66,5.13 v37.74,5.04 | v40.51,3.05 39.6,3.05 U3.4
  Bottom 0.2: v20.7,25.48 20.7,25.05 20.17,24.52 20.17,22.64 20.57,22.25 21.55,22.25 22.54,21.27 22.54,19.11 23.27,18.37 23.27,17.93 22.94,17.6 22.94,16.54 23.64,15.84 23.64,14.84 27.56,10.92 29.71,10.92 29.73,10.95 31.46,10.95 33.1,9.31 v33.1,6.35 | v37.74,5.04 38.71,4.08 38.71,3.72 39.38,3.05 v40.51,3.05
XTAL1
  Top 0.254: U1.8 16.75,14.44 XTAL1.OSC1 19.8,12.83 C3.2
XTAL2
  Top 0.254: U1.7 16.25,14.41 XTAL1.OSC2 13.48,12.83 C2.2

### Text on the board
tDocu: LOG | STAT | AUX | J0 | RST
bDocu: GND | 3v3 | TX | Project Margay v3.0 / -------------- / Northern Widget & / University of Minnesota | RX | A0 | SDA / OB | D0 | REF | J2 | GND | Ax | SDA / EXT | 3v3 | B+ | ± | SDA | B- | 3v3 | SCL | Vs | Vs | J1 | VBat | GND
_bsilk: J2